# Altium project Tesis.PrjPcb (part 1 of 2)
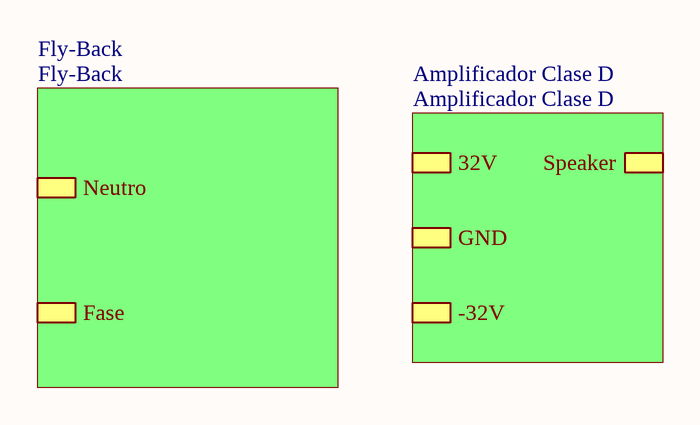
[diagram p0: Diagrama en bloques.SchDoc]
15 sheets, 358 parts. Net scope: hierarchical (ports join the sheet entries above them; power ports are global).
Board files: Filtros.PcbDoc, Flyback.PcbDoc, Amplificador Clase D.PcbDoc, Micro y BT.PcbDoc
Sheets:
  Diagrama en bloques.SchDoc
    Amplificador Clase D = Amplificador Clase D.SchDoc
      Triangular = Triangular.SchDoc
      Generador De Retardo = Generador De Retardo.SchDoc
      Mosfet Driver = Mosfet Driver.SchDoc
      Feedback = Feedback.SchDoc
      U_Filtros = Filtros.SchDoc
        Pasa Bajos = Pasa Bajos.SchDoc
        Pasa Altos = Pasa Altos.SchDoc
        Pasa Banda Inferior = Pasa Banda Inferior.SchDoc
        Pasa Banda Superior = Pasa Banda Superior.SchDoc
      Micro y BT = Micro y BT.SchDoc
    Fly-Back = Fly-Back.SchDoc
      Positive Pwr = Positive Pwr.SchDoc
      Negative Pwr = Negative Pwr.SchDoc

## Sheet Diagrama en bloques.SchDoc
size A4; DocumentNumber: 1; SheetNumber: 1; SheetTotal: 5

### Sub-sheets
Amplificador Clase D = Amplificador Clase D: Speaker, 32V, GND, -32V
Fly-Back = Fly-Back: Fase, Neutro

## Sheet Amplificador Clase D.SchDoc
size A3; DocumentNumber: 5; SheetNumber: 5; SheetTotal: 5
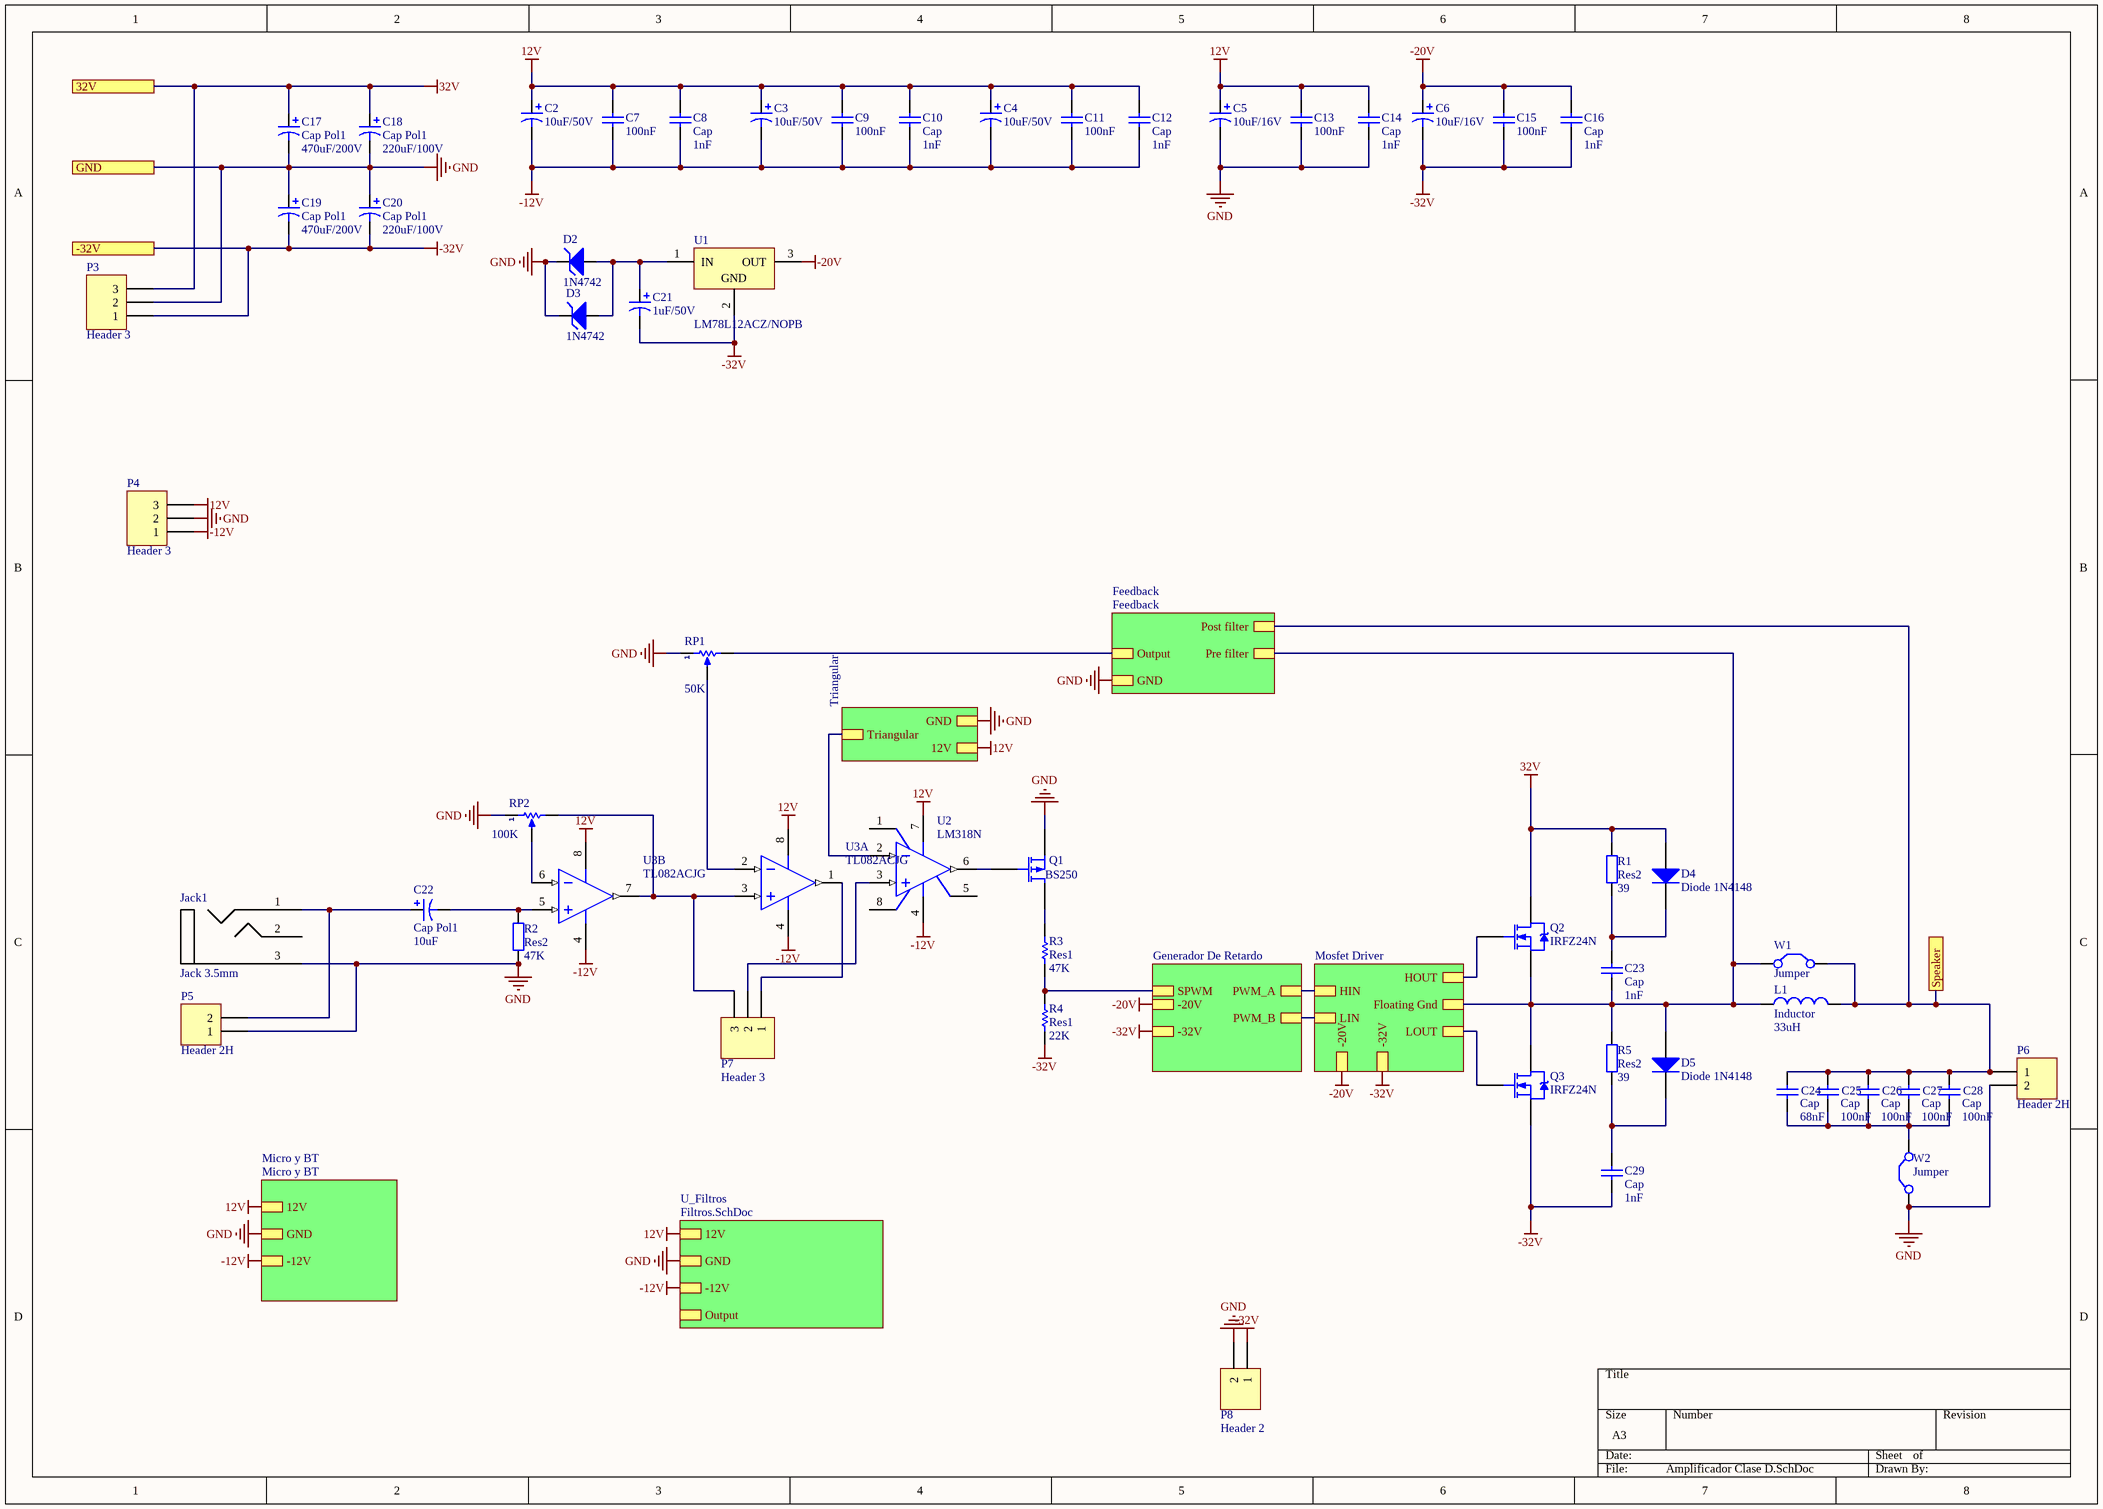
[diagram p1: Amplificador Clase D.SchDoc]

### Parts
C2  VALOR: 10uF/50V  [CAPR D250 H450 R100 mil]  (hidden comment: Cap Electrolitico Radial)
C3  VALOR: 10uF/50V  [CAPR D250 H450 R100 mil]  (hidden comment: Cap Electrolitico Radial)
C4  VALOR: 10uF/50V  [CAPR D250 H450 R100 mil]  (hidden comment: Cap Electrolitico Radial)
C5  VALOR: 10uF/16V  [CAPR D250 H450 R100 mil]  (hidden comment: Cap Electrolitico Radial)
C6  VALOR: 10uF/16V  [CAPR D250 H450 R100 mil]  (hidden comment: Cap Electrolitico Radial)
C7  VALOR: 100nF  [RAD-0.3]  (hidden comment: Cap Ceramico Disco)
C8  Cap  value 1nF  [CAP DISCO 200mil]
C9  VALOR: 100nF  [RAD-0.3]  (hidden comment: Cap Ceramico Disco)
C10  Cap  value 1nF  [CAP DISCO 200mil]
C11  VALOR: 100nF  [RAD-0.3]  (hidden comment: Cap Ceramico Disco)
C12  Cap  value 1nF  [CAP DISCO 200mil]
C13  VALOR: 100nF  [RAD-0.3]  (hidden comment: Cap Ceramico Disco)
C14  Cap  value 1nF  [CAP DISCO 200mil]
C15  VALOR: 100nF  [RAD-0.3]  (hidden comment: Cap Ceramico Disco)
C16  Cap  value 1nF  [CAP DISCO 200mil]
C17  Cap Pol1  value 470uF/200V  [CAPR D700 H1400 R300 mil]
C18  Cap Pol1  value 220uF/100V  [CAPR D500 H1000 R200 mil]
C19  Cap Pol1  value 470uF/200V  [CAPR D700 H1400 R300 mil]
C20  Cap Pol1  value 220uF/100V  [CAPR D500 H1000 R200 mil]
C21  VALOR: 1uF/50V  [CAPR D250 H450 R100 mil]  (hidden comment: Cap Electrolitico Radial)
C22  Cap Pol1  value 10uF  [CAPR D250 H450 R100 mil]
C23  Cap  value 1nF  [CAP DISCO 200mil]
C24  Cap  value 68nF  [RAD-0.4]
C25  Cap  value 100nF  [RAD-0.4]
C26  Cap  value 100nF  [RAD-0.4]
C27  Cap  value 100nF  [RAD-0.4]
C28  Cap  value 100nF  [RAD-0.4]
C29  Cap  value 1nF  [CAP DISCO 200mil]
D2  VALOR: 1N4742  [DO-41]  (hidden comment: Diodo Zener)
D3  VALOR: 1N4742  [DO-41]  (hidden comment: Diodo Zener)
D4  Diode 1N4148  [DO-41]
D5  Diode 1N4148  [DO-41]
Jack1  Jack 3.5mm  [jack 3.5mm]
L1  Inductor  value 33uH  [Bobina 1.5*3]
P3  Header 3  [bornera 3]
P4  Header 3  [bornera 3]
P5  Header 2H  [bornera 2]
P6  Header 2H  [bornera 2]
P7  Header 3  [HDR1X3]
P8  Header 2  [HDR1X2]
Q1  BS250  [TO-92W]
Q2  IRFZ24N  [TO-220AB]
Q3  IRFZ24N  [TO-220AB]
R1  Res2  value 39  [AXIAL-0.4]
R2  Res2  value 47K  [1206 resistor]
R3  Res1  value 47K  [1206 resistor]
R4  Res1  value 22K  [1206 resistor]
R5  Res2  value 39  [AXIAL-0.4]
RP1  VALOR: 50K  [Trimpot Multivuelta Vertical]  (hidden comment: Trimpot)
RP2  VALOR: 100K  [Trimpot Multivuelta Vertical]  (hidden comment: Trimpot)
U1  LM78L12ACZ/NOPB  [to-220]
U2  LM318N  [DIP-8]
U3  TL082ACJG  [693-02]  (parts A,B of 2)
W1  Jumper  [RAD-0.2]
W2  Jumper  [RAD-0.2]

### Sub-sheets
Feedback = Feedback: Output, Pre filter, Post filter, GND
Generador De Retardo = Generador De Retardo: SPWM, PWM_A, PWM_B, -20V, -32V
Micro y BT = Micro y BT: 12V, GND, -12V
Mosfet Driver = Mosfet Driver: HIN, LIN, HOUT, LOUT, Floating Gnd, -20V, -32V
Triangular = Triangular: Triangular, 12V, GND
U_Filtros = Filtros.SchDoc: 12V, Output, GND, -12V

### Ports
32V, -32V, GND, Speaker

### Nets
12V: C2.1 C3.1 C4.1 C5.1 C7.2 C8.2 C9.2 C10.2 C11.2 C12.2 C13.2 C14.2 P4.3 U2.7(V+) U3.8(V+) ; sheet Triangular/12V, sheet U_Filtros/12V, sheet Micro y BT/12V
32V: C17.1 C18.1 D4.1(A) P3.3 Q2.2(D) R1.2 ; port 32V
-12V: C2.2 C3.2 C4.2 C7.1 C8.1 C9.1 C10.1 C11.1 C12.1 P4.1 U2.4(V-) U3.4(V-) ; sheet U_Filtros/-12V, sheet Micro y BT/-12V
-20V: C6.1 C15.2 C16.2 U1.3(OUT) ; sheet Generador De Retardo/-20V, sheet Mosfet Driver/-20V
-32V: C6.2 C15.1 C16.1 C19.2 C20.2 C21.2 C29.1 P3.1 P8.1 Q3.3(S) R4.1 U1.2(GND) ; port -32V, sheet Generador De Retardo/-32V, sheet Mosfet Driver/-32V
GND: C5.2 C13.1 C14.1 C17.2 C18.2 C19.1 C20.1 D2.2(K) D3.2(K) Jack1.3(Gnd) P3.2 P4.2 P5.1 P6.2 P8.2 Q1.3(S) R2.1 RP1.1(TOP) RP2.1(TOP) W2.1(C1) ; port GND, sheet Triangular/GND, sheet Feedback/GND, sheet U_Filtros/GND, sheet Micro y BT/GND
Net1_3: R3.1 R4.2 ; sheet Generador De Retardo/SPWM
Net1_6: sheet Generador De Retardo/PWM_B, sheet Mosfet Driver/LIN
Net1_12: sheet Generador De Retardo/PWM_A, sheet Mosfet Driver/HIN
NetC21_1: C21.1 D2.1(A) D3.1(A) U1.1(IN)
NetC22_1: C22.1 Jack1.1(R) P5.2
NetC22_2: C22.2 R2.2 U3.5(IN+)
NetC23_1: C23.1 D5.1(A) L1.1 Q2.3(S) Q3.2(D) R5.2 W1.1(C1) ; sheet Mosfet Driver/Floating Gnd, sheet Feedback/Pre filter
NetC23_2: C23.2 D4.2(K) R1.1
NetC24_1: C24.1 C25.1 C26.1 C27.1 C28.1 W2.2(C2)
NetC24_2: C24.2 C25.2 C26.2 C27.2 C28.2 L1.2 P6.1 W1.2(C2) ; port Speaker, sheet Feedback/Post filter
NetC29_2: C29.2 D5.2(K) R5.1
NetD8_1: Q2.1(G) ; sheet Mosfet Driver/HOUT
NetD10_1: Q3.1(G) ; sheet Mosfet Driver/LOUT
NetP7_1: P7.1 U3.1(OUT)
NetP7_2: P7.2 U2.3(IN+)
NetP7_3: P7.3 RP2.2(BOT) U3.3(IN+) U3.7(OUT)
NetP14_2: RP1.2(BOT) ; sheet Feedback/Output
NetQ1_1: Q1.1(D) R3.2
NetQ1_2: Q1.2(G) U2.6(OUT)
NetR7_1: U2.2(IN-) ; sheet Triangular/Triangular
NetRP1_3: RP1.3(TAP) U3.2(IN-)
NetRP2_3: RP2.3(TAP) U3.6(IN-)

Not connected (* = marked no-connect by the designer): Jack1 2(L); U2 1(BAL/COMP1) 5(BAL/COMP3) 8(COMP2)

### Library data of the parts
C2-C6 C21 = Cap Electrolitico Radial: Cap Electrolitico de insercion; CODIGO STI: *; PROVEEDOR: *; FABRICANTE: *
C7 C9 C11 C13 C15 = Cap Ceramico Disco: Capacitor Ceramico de Insercion; FABRICANTE: Generico; CODIGO STI: *; PROVEEDOR: *
C8 C10 C12 C14 C16 C23-C29 = Cap: Capacitor; Published: 8-Jun-2000; LatestRevisionDate: 17-Jul-2002; LatestRevisionNote: Re-released for DXP Platform.; PackageReference: RAD-0.3; Publisher: Altium Limited; PackageDescription: Radial Cap, Thru-Hole; 2 Leads; 0.3 in Pin Spacing
C17-C20 C22 = Cap Pol1: Polarized Capacitor (Radial); Published: 8-Jun-2000; LatestRevisionDate: 17-Jul-2002; LatestRevisionNote: Re-released for DXP Platform.; PackageReference: RB7.6-15; Publisher: Altium Limited; PackageDescription: Polarized Capacitor (Radial); 2 Leads
D4 D5 = Diode 1N4148: High Conductance Fast Diode; Published: 8-Jun-2000; LatestRevisionDate: 17-Jul-2002; LatestRevisionNote: Re-released for DXP Platform.; DatasheetVersion: 1997; PackageReference: DO-35; Publisher: Altium Limited; PackageDescription: Diode, Axial; Body 3.8 x 1.9 mm (LxDia. max), Lead Dia. 0.53 mm (max); Code_JEDEC: DO-204-AH; ComponentLink1Description: Manufacturer Link; ComponentLink1URL: http://www.fairchildsemi.com/; ComponentLink2Description: Datasheet; ComponentLink2URL: http://www.fairchildsemi.com/ds/1N%2F1N4148.pdf
L1 = Inductor: Code_IEC: 1005; Published: 8-Jun-2000; LatestRevisionDate: 29-May-2009; LatestRevisionNote: IPC-7351 Footprint Added.; PackageReference: 0402-A; Publisher: Altium Limited; PackageDescription: Chip Inductor; Code_JEITA: 0402
P3 P4 P7 = Header 3: Header, 3-Pin; LatestRevisionDate: 17-Jul-2002; LatestRevisionNote: Re-released for DXP Platform.; Publisher: Altium Limited
P5 P6 = Header 2H: Header, 2-Pin, Right Angle; LatestRevisionDate: 17-Jul-2002; LatestRevisionNote: Re-released for DXP Platform.; Publisher: Altium Limited
P8 = Header 2: Header, 2-Pin; LatestRevisionDate: 17-Jul-2002; LatestRevisionNote: Re-released for DXP Platform.; Publisher: Altium Limited
Q1 = MOSFET-P: P-Channel MOSFET; Published: 8-Jun-2000; LatestRevisionDate: 17-Jul-2002; LatestRevisionNote: Re-released for DXP Platform.; PackageVersion: 1995/1996; PackageReference: E3; Publisher: Altium Limited; PackageDescription: TO, Flat Index; 3 In-Line, Axial Leads; Body Dia. 4.6mm; Lead Dia. 0.5 mm (max)
Q2 Q3 = IRFZ24N: HEXFET Power MOSFET; Note: Pin 2 is electrically connected to pin 4.; Published: 8-Jun-2000; LatestRevisionDate: 17-Jul-2002; LatestRevisionNote: Re-released for DXP Platform.; DatasheetVersion: Sep-1999; PackageVersion: Feb-1997; PackageReference: TO-220AB; Publisher: Altium Limited; PackageDescription: TO, Thru-Hole, Vertical, Heatsink Mounted; 3 In-Line Leads; Pitch 2.54 mm; ComponentLink1Description: Manufacturer Link; ComponentLink1URL: http://www.irf.com/; ComponentLink2Description: Datasheet; ComponentLink2URL: http://www.irf.com/product-info/datasheets/data/irfz24n.pdf
R1 R2 R5 = Res2: Resistor; Published: 8-Jun-2000; LatestRevisionDate: 17-Jul-2002; LatestRevisionNote: Re-released for DXP Platform.; PackageReference: AXIAL-0.4; Publisher: Altium Limited; PackageDescription: Axial Device, Thru-Hole; 2 Leads; 0.4 in Pin Spacing
R3 R4 = Res1: Resistor; Published: 8-Jun-2000; LatestRevisionDate: 17-Jul-2002; LatestRevisionNote: Re-released for DXP Platform.; PackageReference: AXIAL-0.3; Publisher: Altium Limited; PackageDescription: Axial Device, Thru-Hole; 2 Leads; 0.3 in Pin Spacing
RP1 RP2 = Trimpot: Preset; CODIGO STI: *; PROVEEDOR: *; FABRICANTE: *
U1 = LM78L12ACZ/NOPB: 3-Terminal Positive Regulators, 3-pin TO-92, Pb-Free; Manufacturer: National Semiconductor; PackageTopMarking: NSXYTT*LM78L*12ACZ; PowerWise: N; CompType: LDO IC; Published: 1-Mar-2010; DatasheetVersion: Apr-2006; PackageVersion: revG, Sep-2000; PackageReference: Z03A; Publisher: Altium Limited; PackageDescription: TO-92, Molded, 3 Lead; Supplier 1: Digi-Key; Supplier Part Number 1: LM78L12ACZ/NOPB-ND; Supplier 2: Farnell; Supplier Part Number 2: 1469110; PartNumber: LM78L12ACZ/NOPB; RoHS: Y; PinCount: 3; Code_JEDEC: TO-226-AA; ComponentLink1Description: LM78L12 Datasheet; ComponentLink1URL: http://www.national.com/ds/LM/LM78L12.pdf; ComponentLink2Description: LM78L12 Web Page; ComponentLink2URL: http://www.national.com/pf/LM/LM78L12.html; ComponentLink3Description: Z03A Package Page; ComponentLink3URL: http://www.national.com/packaging/folders/z03a.html
U2 = LM318N: Operational Amplifier, 8-pin MDIP; Manufacturer: National Semiconductor; PackageTopMarking: NSUZXYTTE#*LM*318N; PowerWise: N; CompType: Amplifiers; Published: 4-Dec-2008; DatasheetVersion: Aug-2000; PackageVersion: revG, May-2006; PackageReference: N08E; Publisher: Altium Limited; PackageDescription: MDIP, .365 x .250 x .130in, 8 Lead, .100in Pitch; Supplier 1: Farnell; Supplier Part Number 1: 398550; PartNumber: LM318N; RoHS: N; PinCount: 8; Code_JEDEC: MS-001-BA; ComponentLink1Description: LM318 Datasheet; ComponentLink1URL: http://www.national.com/ds/LM/LM318.pdf; ComponentLink2Description: LM318 Web Page; ComponentLink2URL: http://www.national.com/pf/LM/LM318.html; ComponentLink3Description: N08E Package Page; ComponentLink3URL: http://www.national.com/packaging/folders/n08e.html
U3 = TL082ACJG: JFET-Input Operational Amplifier; Published: 17-Jul-2002; LatestRevisionDate: 06-Jun-2005; LatestRevisionNote: Stylized 3D Model Added.; DatasheetVersion: 1988; PackageReference: 693-02; Publisher: Altium Limited; PackageDescription: DIP; 8 Leads; Row Spacing 7.62 mm; Pitch 2.54 mm; Code_JEDEC: MO-001-AN; ComponentLink1Description: Manufacturer Link; ComponentLink1URL: http://www.onsemi.com/site/products/parametrics/0,4446,251,00.html
W1 W2 = Jumper: Jumper Wire; Published: 24-Mar-1999; LatestRevisionDate: 17-Jul-2002; LatestRevisionNote: Re-released for DXP Platform.; PackageReference: RAD-0.2; Publisher: Altium Limited; PackageDescription: Radial Cap, Thru-Hole; 2 Leads; 0.2 in Pin Spacing
D2 D3 = Diodo Zener: CODIGO STI: *; PROVEEDOR: *; FABRICANTE: *

## Sheet Triangular.SchDoc
size A4
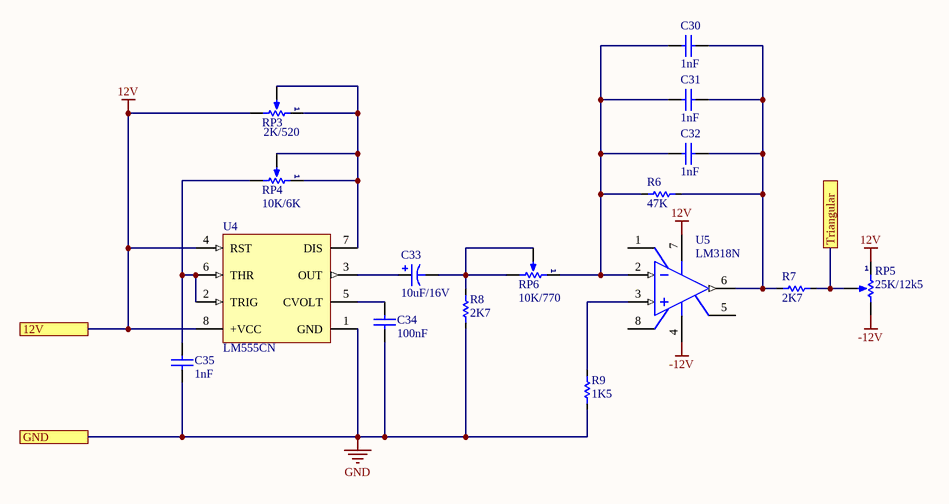
[diagram p2: Triangular.SchDoc]

### Parts
C30  VALOR: 1nF  [CAP DISCO 200mil]  (hidden comment: Cap Ceramico Disco)
C31  VALOR: 1nF  [CAP DISCO 200mil]  (hidden comment: Cap Ceramico Disco)
C32  VALOR: 1nF  [CAP DISCO 200mil]  (hidden comment: Cap Ceramico Disco)
C33  VALOR: 10uF/16V  [CAPR D250 H450 R100 mil]  (hidden comment: Cap Electrolitico Radial)
C34  VALOR: 100nF  [RAD-0.3]  (hidden comment: Cap Ceramico Disco)
C35  VALOR: 1nF  [CAP DISCO 200mil]  (hidden comment: Cap Ceramico Disco)
R6  VALOR: 47K  [1206 resistor]  (hidden comment: Res SMD)
R7  VALOR: 2K7  [1206 resistor]  (hidden comment: Res SMD)
R8  VALOR: 2K7  [1206 resistor]  (hidden comment: Res SMD)
R9  VALOR: 1K5  [1206 resistor]  (hidden comment: Res SMD)
RP3  VALOR: 2K/520  [Trimpot Multivuelta Vertical]  (hidden comment: Trimpot)
RP4  VALOR: 10K/6K  [Trimpot Multivuelta Vertical]  (hidden comment: Trimpot)
RP5  VALOR: 25K/12k5  [Trimpot Multivuelta Vertical]  (hidden comment: Trimpot)
RP6  VALOR: 10K/770  [Trimpot Multivuelta Vertical]  (hidden comment: Trimpot)
U4  LM555CN  [N08E]
U5  LM318N  [DIP-8]

### Ports
12V, GND, Triangular

### Nets
12V: RP3.2(BOT) RP5.1(TOP) U4.4(RST) U4.8(+VCC) U5.7(V+) ; port 12V
-12V: RP5.2(BOT) U5.4(V-)
GND: C34.1 C35.1 R8.1 R9.1 U4.1(GND) ; port GND
NetC30_1: C30.1 C31.1 C32.1 R6.1 R7.2 U5.6(OUT)
NetC30_2: C30.2 C31.2 C32.2 R6.2 RP6.1(TOP) U5.2(IN-)
NetC33_1: C33.1 U4.3(OUT)
NetC33_2: C33.2 R8.2 RP6.2(BOT) RP6.3(TAP)
NetC34_2: C34.2 U4.5(CVOLT)
NetC35_2: C35.2 RP4.2(BOT) U4.2(TRIG) U4.6(THR)
NetR7_1: R7.1 RP5.3(TAP) ; port Triangular
NetR9_2: R9.2 U5.3(IN+)
NetRP3_1: RP3.1(TOP) RP3.3(TAP) RP4.1(TOP) RP4.3(TAP) U4.7(DIS)

Not connected (* = marked no-connect by the designer): U5 1(BAL/COMP1) 5(BAL/COMP3) 8(COMP2)

### Library data of the parts
C30-C32 C34 C35 = Cap Ceramico Disco: as C7 on sheet Amplificador Clase D; CODIGO STI: *; PROVEEDOR: *
C33 = Cap Electrolitico Radial: Cap Electrolitico de insercion; CODIGO STI: *; PROVEEDOR: *; FABRICANTE: *
RP3-RP6 = Trimpot: Preset; CODIGO STI: *; PROVEEDOR: *; FABRICANTE: *
U4 = LM555CN: Timer, 8-pin MDIP; Manufacturer: National Semiconductor; PackageTopMarking: NSUZXYTTE#*LM*555CN; PowerWise: N; CompType: Analog IC; Published: 4-Dec-2008; DatasheetVersion: Jul-2006; PackageVersion: revG, May-2006; PackageReference: N08E; Publisher: Altium Limited; PackageDescription: MDIP, .365 x .250 x .130in, 8 Lead, .100in Pitch; Supplier 1: Farnell; Supplier Part Number 1: 9488235; PartNumber: LM555CN; RoHS: N; PinCount: 8; Code_JEDEC: MS-001-BA; ComponentLink1Description: LM555 Datasheet; ComponentLink1URL: http://www.national.com/ds/LM/LM555.pdf; ComponentLink2Description: LM555 Web Page; ComponentLink2URL: http://www.national.com/pf/LM/LM555.html; ComponentLink3Description: N08E Package Page; ComponentLink3URL: http://www.national.com/packaging/folders/n08e.html
U5 = LM318N: as U2 on sheet Amplificador Clase D; Published: 4-Dec-2008; DatasheetVersion: Aug-2000; PackageVersion: revG, May-2006; PackageReference: N08E; Publisher: Altium Limited; PackageDescription: MDIP, .365 x .250 x .130in, 8 Lead, .100in Pitch; Supplier 1: Farnell; Supplier Part Number 1: 398550; PartNumber: LM318N; RoHS: N; PinCount: 8; Code_JEDEC: MS-001-BA; ComponentLink1Description: LM318 Datasheet; ComponentLink1URL: http://www.national.com/ds/LM/LM318.pdf; ComponentLink2Description: LM318 Web Page; ComponentLink2URL: http://www.national.com/pf/LM/LM318.html; ComponentLink3Description: N08E Package Page; ComponentLink3URL: http://www.national.com/packaging/folders/n08e.html
R6-R9 = Res SMD: CODIGO STI: *; PROVEEDOR: *; FABRICANTE: *

## Sheet Generador De Retardo.SchDoc
size A4
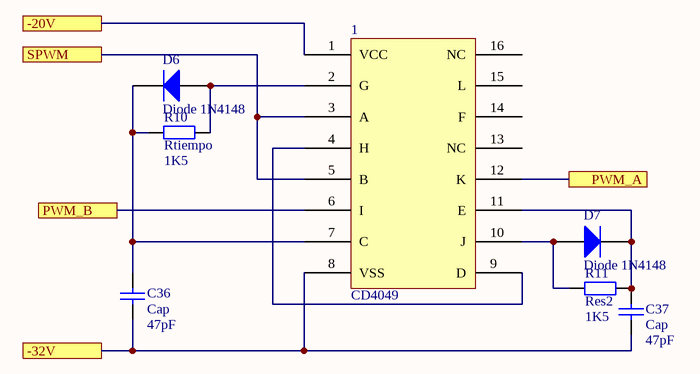
[diagram p3: Generador De Retardo.SchDoc]

### Parts
1  CD4049  [PDIP16]
C36  Cap  value 47pF  [CAP DISCO 200mil]
C37  Cap  value 47pF  [CAP DISCO 200mil]
D6  Diode 1N4148  [SOD323-F]
D7  Diode 1N4148  [SOD323-F]
R10  Rtiempo  value 1K5  [1206 resistor]
R11  Res2  value 1K5  [1206 resistor]

### Ports
-20V, -32V, PWM_A, PWM_B, SPWM

### Nets
-20V: 1.1(VCC) ; port -20V
-32V: 1.8(VSS) C36.1 C37.1 ; port -32V
Net1_2: 1.2(G) D6.1(A) R10.2
Net1_3: 1.3(A) 1.5(B) ; port SPWM
Net1_4: 1.4(H) 1.9(D)
Net1_6: 1.6(I) ; port PWM_B
Net1_7: 1.7(C) C36.2 D6.2(K) R10.1
Net1_10: 1.10(J) D7.1(A) R11.1
Net1_11: 1.11(E) C37.2 D7.2(K) R11.2
Net1_12: 1.12(K) ; port PWM_A

Not connected (* = marked no-connect by the designer): 1 13(NC) 14(F) 15(L) 16(NC)

### Library data of the parts
C36 C37 = Cap: Capacitor; Published: 8-Jun-2000; LatestRevisionDate: 17-Jul-2002; LatestRevisionNote: Re-released for DXP Platform.; PackageReference: RAD-0.3; Publisher: Altium Limited; PackageDescription: Radial Cap, Thru-Hole; 2 Leads; 0.3 in Pin Spacing
D6 D7 = Diode 1N4148: High Conductance Fast Diode; Published: 8-Jun-2000; LatestRevisionDate: 17-Jul-2002; LatestRevisionNote: Re-released for DXP Platform.; DatasheetVersion: 1997; PackageReference: DO-35; Publisher: Altium Limited; PackageDescription: Diode, Axial; Body 3.8 x 1.9 mm (LxDia. max), Lead Dia. 0.53 mm (max); Code_JEDEC: DO-204-AH; ComponentLink1Description: Manufacturer Link; ComponentLink1URL: http://www.fairchildsemi.com/; ComponentLink2Description: Datasheet; ComponentLink2URL: http://www.fairchildsemi.com/ds/1N%2F1N4148.pdf
R10 R11 = Res2: Resistor; Published: 8-Jun-2000; LatestRevisionDate: 17-Jul-2002; LatestRevisionNote: Re-released for DXP Platform.; PackageReference: AXIAL-0.4; Publisher: Altium Limited; PackageDescription: Axial Device, Thru-Hole; 2 Leads; 0.4 in Pin Spacing

## Sheet Mosfet Driver.SchDoc
size A4
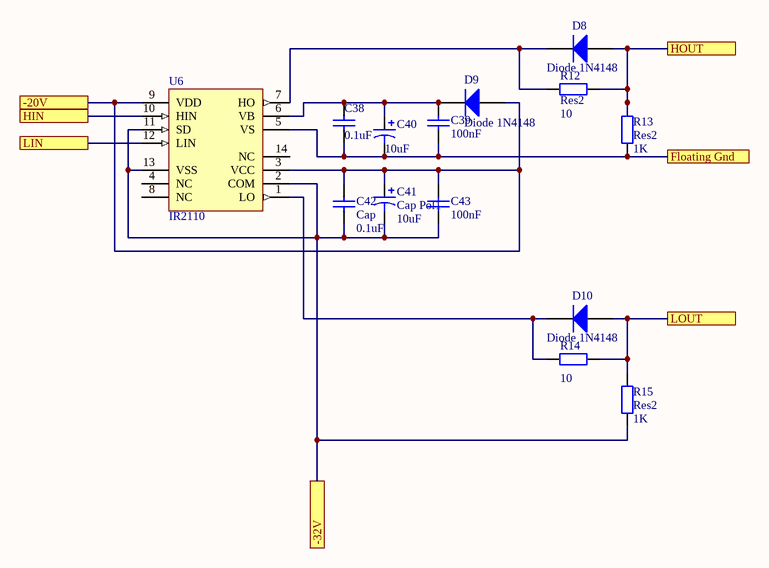
[diagram p4: Mosfet Driver.SchDoc]

### Parts
C38  value 0.1uF  [CAP DISCO 200mil]  (hidden comment: Cap)
C39  VALOR: 100nF  [RAD-0.3]  (hidden comment: Cap Ceramico Disco)
C40  value 10uF  [CAPR D250 H450 R100 mil]  (hidden comment: Cap Pol1)
C41  Cap Pol1  value 10uF  [CAPR D250 H450 R100 mil]
C42  Cap  value 0.1uF  [CAP DISCO 200mil]
C43  VALOR: 100nF  [RAD-0.3]  (hidden comment: Cap Ceramico Disco)
D8  Diode 1N4148  [SOD323-F]
D9  Diode 1N4148  [SOD323-F]
D10  Diode 1N4148  [SOD323-F]
R12  Res2  value 10  [1206 resistor]
R13  Res2  value 1K  [1206 resistor]
R14  value 10  [1206 resistor]  (hidden comment: Res2)
R15  Res2  value 1K  [1206 resistor]
U6  IR2110  [PDIP14]

### Ports
-20V, -32V, Floating Gnd, HIN, HOUT, LIN, LOUT

### Nets
-20V: C41.1 C42.2 C43.2 D9.1(A) U6.3(VCC) U6.9(VDD) ; port -20V
-32V: C41.2 C42.1 C43.1 R15.2 U6.2(COM) U6.11(SD) U6.13(VSS) ; port -32V
Net1_6: U6.12(LIN) ; port LIN
Net1_12: U6.10(HIN) ; port HIN
NetC23_1: C38.1 C39.1 C40.2 R13.1 U6.5(VS) ; port Floating Gnd
NetC38_2: C38.2 C39.2 C40.1 D9.2(K) U6.6(VB)
NetD8_1: D8.1(A) R12.2 R13.2 ; port HOUT
NetD8_2: D8.2(K) R12.1 U6.7(HO)
NetD10_1: D10.1(A) R14.1 R15.1 ; port LOUT
NetD10_2: D10.2(K) R14.2 U6.1(LO)

Not connected (* = marked no-connect by the designer): U6 4(NC) 8(NC) 14(NC)

### Library data of the parts
C38 C42 = Cap: Capacitor; Published: 8-Jun-2000; LatestRevisionDate: 17-Jul-2002; LatestRevisionNote: Re-released for DXP Platform.; PackageReference: RAD-0.3; Publisher: Altium Limited; PackageDescription: Radial Cap, Thru-Hole; 2 Leads; 0.3 in Pin Spacing
C39 C43 = Cap Ceramico Disco: as C7 on sheet Amplificador Clase D; CODIGO STI: *; PROVEEDOR: *
C40 C41 = Cap Pol1: Polarized Capacitor (Radial); Published: 8-Jun-2000; LatestRevisionDate: 17-Jul-2002; LatestRevisionNote: Re-released for DXP Platform.; PackageReference: RB7.6-15; Publisher: Altium Limited; PackageDescription: Polarized Capacitor (Radial); 2 Leads
D8-D10 = Diode 1N4148: High Conductance Fast Diode; Published: 8-Jun-2000; LatestRevisionDate: 17-Jul-2002; LatestRevisionNote: Re-released for DXP Platform.; DatasheetVersion: 1997; PackageReference: DO-35; Publisher: Altium Limited; PackageDescription: Diode, Axial; Body 3.8 x 1.9 mm (LxDia. max), Lead Dia. 0.53 mm (max); Code_JEDEC: DO-204-AH; ComponentLink1Description: Manufacturer Link; ComponentLink1URL: http://www.fairchildsemi.com/; ComponentLink2Description: Datasheet; ComponentLink2URL: http://www.fairchildsemi.com/ds/1N%2F1N4148.pdf
R12-R15 = Res2: Resistor; Published: 8-Jun-2000; LatestRevisionDate: 17-Jul-2002; LatestRevisionNote: Re-released for DXP Platform.; PackageReference: AXIAL-0.4; Publisher: Altium Limited; PackageDescription: Axial Device, Thru-Hole; 2 Leads; 0.4 in Pin Spacing
U6 = IR2110: High and Low Side Driver; Note: Pins 4, 8 and 14 are not connected; Published: 8-Jun-2000; LatestRevisionDate: 04-Mar-2005; LatestRevisionNote: Stylized 3D Model Added.; DatasheetVersion: PD60147J; PackageReference: PDIP14; Publisher: Altium Limited; PackageDescription: DIP; 14 Leads; Row Spacing 7.62 mm; Pitch 2.54 mm; ComponentLink1Description: Manufacturer Link; ComponentLink1URL: http://www.irf.com/; ComponentLink2Description: Datasheet; ComponentLink2URL: http://www.irf.com/product-info/datasheets/data/ir2110.pdf

## Sheet Feedback.SchDoc
size A4
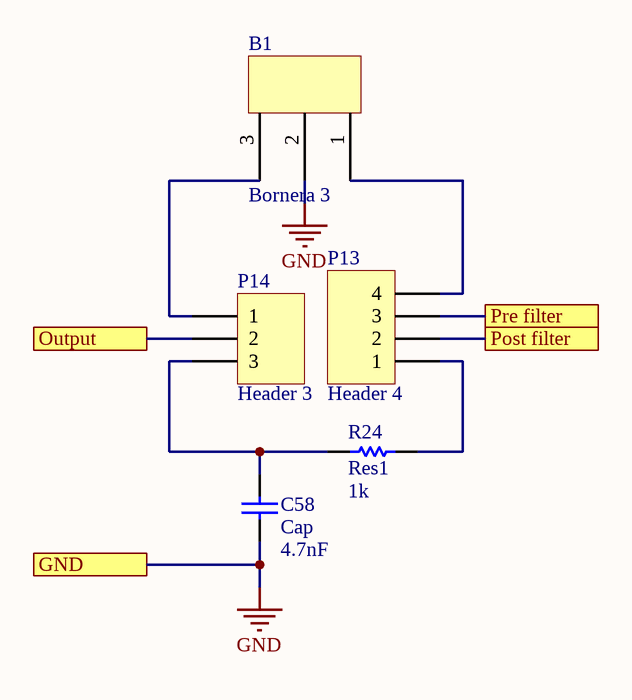
[diagram p5: Feedback.SchDoc]

### Parts
B1  Bornera 3  [bornera 3]
C58  Cap  value 4.7nF  [CAP DISCO 200mil]
P13  Header 4  [HDR1X4]
P14  Header 3  [HDR1X3]
R24  Res1  value 1k  [1206 resistor]

### Ports
GND, Output, Post filter, Pre filter

### Nets
GND: B1.2(L) C58.1 ; port GND
NetB1_1: B1.1(L) P13.4
NetB1_3: B1.3(L) P14.1
NetC23_1: P13.3 ; port Pre filter
NetC24_2: P13.2 ; port Post filter
NetC58_2: C58.2 P14.3 R24.2
NetP13_1: P13.1 R24.1
NetP14_2: P14.2 ; port Output

### Library data of the parts
C58 = Cap: Capacitor; Published: 8-Jun-2000; LatestRevisionDate: 17-Jul-2002; LatestRevisionNote: Re-released for DXP Platform.; PackageReference: RAD-0.3; Publisher: Altium Limited; PackageDescription: Radial Cap, Thru-Hole; 2 Leads; 0.3 in Pin Spacing
P13 = Header 4: Header, 4-Pin; LatestRevisionDate: 17-Jul-2002; LatestRevisionNote: Re-released for DXP Platform.; Publisher: Altium Limited
P14 = Header 3: Header, 3-Pin; LatestRevisionDate: 17-Jul-2002; LatestRevisionNote: Re-released for DXP Platform.; Publisher: Altium Limited
R24 = Res1: Resistor; Published: 8-Jun-2000; LatestRevisionDate: 17-Jul-2002; LatestRevisionNote: Re-released for DXP Platform.; PackageReference: AXIAL-0.3; Publisher: Altium Limited; PackageDescription: Axial Device, Thru-Hole; 2 Leads; 0.3 in Pin Spacing

## Sheet Filtros.SchDoc
size A4; DocumentNumber: 4; SheetNumber: 4; SheetTotal: 5
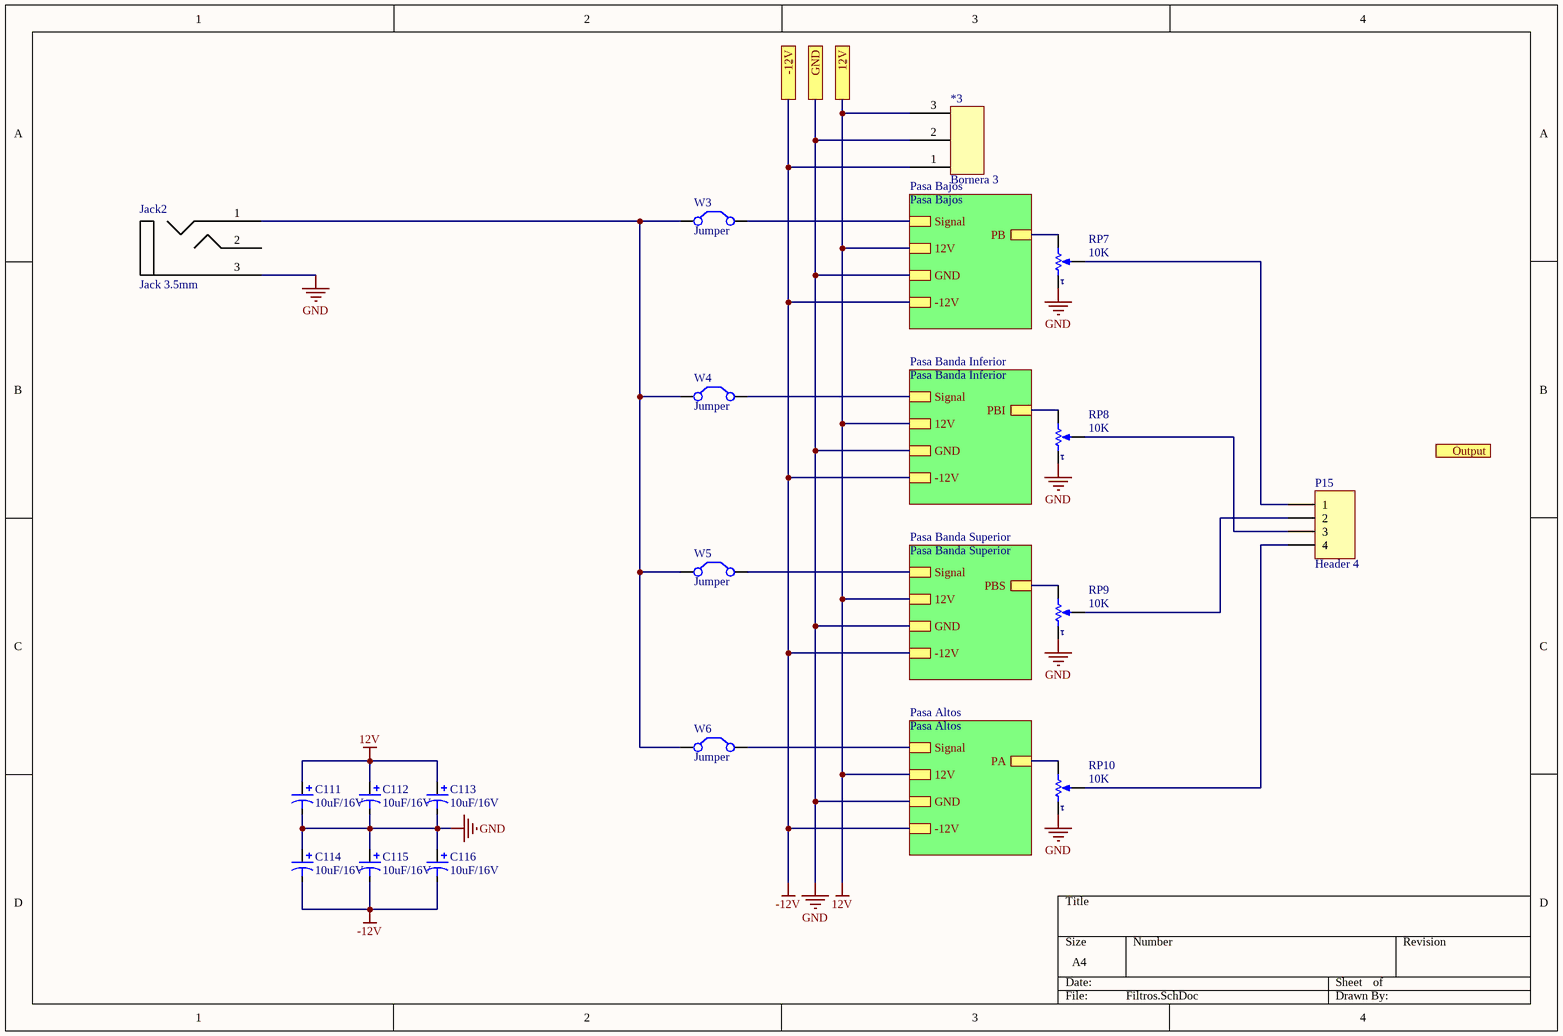
[diagram p6: Filtros.SchDoc]

### Parts
*3  Bornera 3  [bornera 3]
C111  VALOR: 10uF/16V  [CAPR D250 H600 R100 mil]  (hidden comment: Cap Electrolitico Radial)
C112  VALOR: 10uF/16V  [CAPR D250 H600 R100 mil]  (hidden comment: Cap Electrolitico Radial)
C113  VALOR: 10uF/16V  [CAPR D250 H600 R100 mil]  (hidden comment: Cap Electrolitico Radial)
C114  VALOR: 10uF/16V  [CAPR D250 H600 R100 mil]  (hidden comment: Cap Electrolitico Radial)
C115  VALOR: 10uF/16V  [CAPR D250 H600 R100 mil]  (hidden comment: Cap Electrolitico Radial)
C116  VALOR: 10uF/16V  [CAPR D250 H600 R100 mil]  (hidden comment: Cap Electrolitico Radial)
Jack2  Jack 3.5mm  [jack 3.5mm]
P15  Header 4  [Bornera 4]
RP7  VALOR: 10K  [Trimpot Multivuelta Vertical]  (hidden comment: Trimpot)
RP8  VALOR: 10K  [Trimpot Multivuelta Vertical]  (hidden comment: Trimpot)
RP9  VALOR: 10K  [Trimpot Multivuelta Vertical]  (hidden comment: Trimpot)
RP10  VALOR: 10K  [Trimpot Multivuelta Vertical]  (hidden comment: Trimpot)
W3  Jumper  [RAD-0.2]
W4  Jumper  [RAD-0.2]
W5  Jumper  [RAD-0.2]
W6  Jumper  [RAD-0.2]

### Sub-sheets
Pasa Altos = Pasa Altos: Signal, PA, -12V, GND, 12V
Pasa Bajos = Pasa Bajos: Signal, 12V, PB, GND, -12V
Pasa Banda Inferior = Pasa Banda Inferior: Signal, PBI, 12V, GND, -12V
Pasa Banda Superior = Pasa Banda Superior: Signal, PBS, -12V, GND, 12V

### Ports
12V, -12V, GND, Output

### Nets
12V: *3.3(L) C111.1 C112.1 C113.1 ; port 12V, sheet Pasa Bajos/12V, sheet Pasa Altos/12V, sheet Pasa Banda Inferior/12V, sheet Pasa Banda Superior/12V
-12V: *3.1(L) C114.2 C115.2 C116.2 ; port -12V, sheet Pasa Bajos/-12V, sheet Pasa Altos/-12V, sheet Pasa Banda Inferior/-12V, sheet Pasa Banda Superior/-12V
GND: *3.2(L) C111.2 C112.2 C113.2 C114.1 C115.1 C116.1 Jack2.3(Gnd) RP7.1(TOP) RP8.1(TOP) RP9.1(TOP) RP10.1(TOP) ; port GND, sheet Pasa Bajos/GND, sheet Pasa Altos/GND, sheet Pasa Banda Inferior/GND, sheet Pasa Banda Superior/GND
NetC59_2: W6.2(C2) ; sheet Pasa Altos/Signal
NetC68_2: RP7.2(BOT) ; sheet Pasa Bajos/PB
NetJack2_1: Jack2.1(R) W3.1(C1) W4.1(C1) W5.1(C1) W6.1(C1)
NetP15_1: P15.1 RP7.3(TAP)
NetP15_2: P15.2 RP9.3(TAP)
NetP15_3: P15.3 RP8.3(TAP)
NetP15_4: P15.4 RP10.3(TAP)
NetR29_1: RP10.2(BOT) ; sheet Pasa Altos/PA
NetR41_1: W3.2(C2) ; sheet Pasa Bajos/Signal
NetR55_2: RP8.2(BOT) ; sheet Pasa Banda Inferior/PBI
NetR62_1: W4.2(C2) ; sheet Pasa Banda Inferior/Signal
NetR83_2: RP9.2(BOT) ; sheet Pasa Banda Superior/PBS
NetR92_1: W5.2(C2) ; sheet Pasa Banda Superior/Signal

Not connected (* = marked no-connect by the designer): Jack2 2(L)

### Library data of the parts
C111-C116 = Cap Electrolitico Radial: Cap Electrolitico de insercion; CODIGO STI: *; PROVEEDOR: *; FABRICANTE: *; PART NUMBER: *
P15 = Header 4: Header, 4-Pin; LatestRevisionDate: 17-Jul-2002; LatestRevisionNote: Re-released for DXP Platform.; Publisher: Altium Limited
RP7-RP10 = Trimpot: Preset; CODIGO STI: *; PROVEEDOR: *; FABRICANTE: *; PART NUMBER: *
W3-W6 = Jumper: Jumper Wire; Published: 24-Mar-1999; LatestRevisionDate: 17-Jul-2002; LatestRevisionNote: Re-released for DXP Platform.; PackageReference: RAD-0.2; Publisher: Altium Limited; PackageDescription: Radial Cap, Thru-Hole; 2 Leads; 0.2 in Pin Spacing

## Sheet Pasa Bajos.SchDoc
size A4
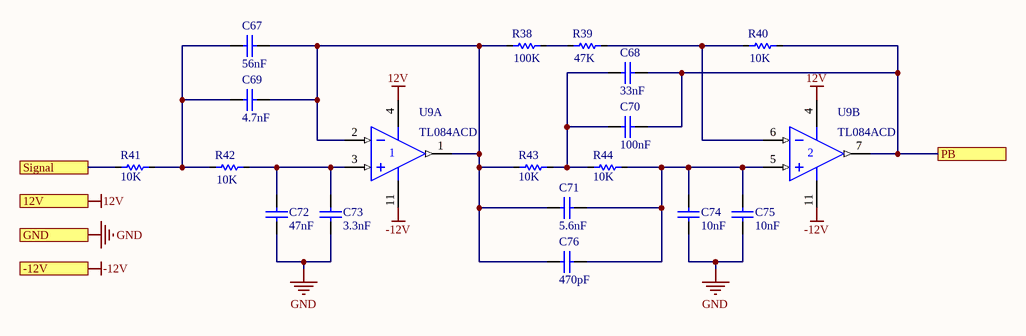
[diagram p7: Pasa Bajos.SchDoc]

### Parts
C67  VALOR: 56nF  [cap 25]  (hidden comment: Cap Ceramico Disco)
C68  VALOR: 33nF  [cap 10]  (hidden comment: Cap Ceramico Disco)
C69  VALOR: 4.7nF  [cap 10]  (hidden comment: Cap Ceramico Disco)
C70  VALOR: 100nF  [CAP DISCO 200mil]  (hidden comment: Cap Ceramico Disco)
C71  VALOR: 5.6nF  [CAP DISCO 200mil]  (hidden comment: Cap Ceramico Disco)
C72  VALOR: 47nF  [cap 10]  (hidden comment: Cap Ceramico Disco)
C73  VALOR: 3.3nF  [CAP DISCO 200mil]  (hidden comment: Cap Ceramico Disco)
C74  VALOR: 10nF  [CAP DISCO 200mil]  (hidden comment: Cap Ceramico Disco)
C75  VALOR: 10nF  [CAP DISCO 200mil]  (hidden comment: Cap Ceramico Disco)
C76  VALOR: 470pF  [CAP DISCO 200mil]  (hidden comment: Cap Ceramico Disco)
R38  VALOR: 100K  [RES AXIAL 400mil]  (hidden comment: Res SMD)
R39  VALOR: 47K  [1206 resistor]  (hidden comment: Res SMD)
R40  VALOR: 10K  [1206 resistor]  (hidden comment: Res SMD)
R41  VALOR: 10K  [1206 resistor]  (hidden comment: Res SMD)
R42  VALOR: 10K  [1206 resistor]  (hidden comment: Res SMD)
R43  VALOR: 10K  [1206 resistor]  (hidden comment: Res SMD)
R44  VALOR: 10K  [1206 resistor]  (hidden comment: Res SMD)
U9  TL084ACD  [751A-02_N]  (parts A,B of 4)

### Ports
12V, -12V, GND, PB, Signal

### Nets
12V: U9.4(V+) ; port 12V
-12V: U9.11(V-) ; port -12V
GND: C72.1 C73.1 C74.2 C75.2 ; port GND
NetC67_1: C67.1 C69.1 C71.2 C76.2 R38.1 R43.1 U9.1(OUT) U9.2(IN-)
NetC67_2: C67.2 C69.2 R41.2 R42.1
NetC68_1: C68.1 C70.1 R43.2 R44.1
NetC68_2: C68.2 C70.2 R40.2 U9.7(OUT) ; port PB
NetC71_1: C71.1 C74.1 C75.1 C76.1 R44.2 U9.5(IN+)
NetC72_2: C72.2 C73.2 R42.2 U9.3(IN+)
NetR38_2: R38.2 R39.1
NetR39_2: R39.2 R40.1 U9.6(IN-)
NetR41_1: R41.1 ; port Signal

### Library data of the parts
C67-C76 = Cap Ceramico Disco: as C7 on sheet Amplificador Clase D; CODIGO STI: *; PROVEEDOR: *
U9 = TL084ACD: JFET-Input Operational Amplifier; Published: 17-Jul-2002; LatestRevisionDate: 13-Apr-2006; LatestRevisionNote: IPC-7351 Footprint Added.; DatasheetVersion: 1988; PackageVersion: 1991; PackageReference: 751A-02; Publisher: Altium Limited; PackageDescription: 14-Pin Small Outline Integrated Circuit 1.27 mm Pitch; Code_IPC: SOIC127P600-14; ComponentLink1Description: Manufacturer Link; ComponentLink1URL: http://www.onsemi.com/site/products/parametrics/0,4446,251,00.html
R38-R44 = Res SMD: CODIGO STI: *; PROVEEDOR: *; FABRICANTE: *; PART NUMBER: *

## Sheet Pasa Altos.SchDoc
size A4
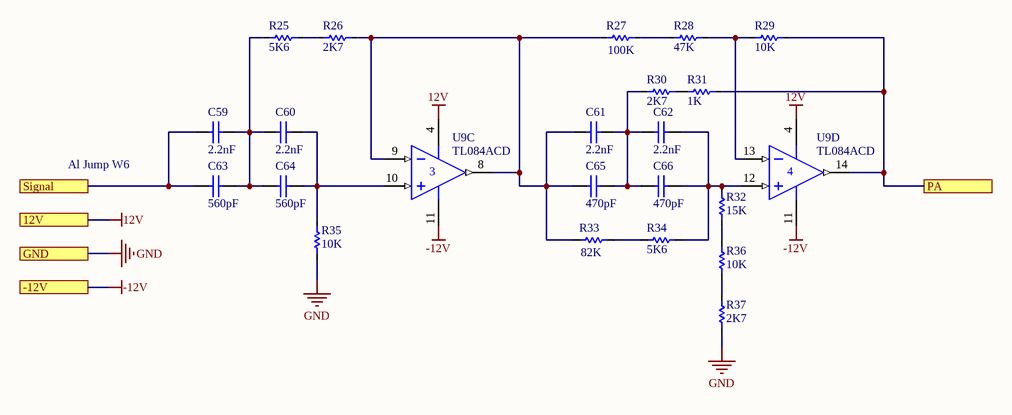
[diagram p8: Pasa Altos.SchDoc]

### Parts
C59  VALOR: 2.2nF  [cap 10]  (hidden comment: Cap Ceramico Disco)
C60  VALOR: 2.2nF  [cap 10]  (hidden comment: Cap Ceramico Disco)
C61  VALOR: 2.2nF  [cap 10]  (hidden comment: Cap Ceramico Disco)
C62  VALOR: 2.2nF  [cap 10]  (hidden comment: Cap Ceramico Disco)
C63  VALOR: 560pF  [CAP DISCO 200mil]  (hidden comment: Cap Ceramico Disco)
C64  VALOR: 560pF  [CAP DISCO 200mil]  (hidden comment: Cap Ceramico Disco)
C65  VALOR: 470pF  [cap 10]  (hidden comment: Cap Ceramico Disco)
C66  VALOR: 470pF  [cap 10]  (hidden comment: Cap Ceramico Disco)
R25  VALOR: 5K6  [1206 resistor]  (hidden comment: Res SMD)
R26  VALOR: 2K7  [1206 resistor]  (hidden comment: Res SMD)
R27  VALOR: 100K  [RES AXIAL 400mil]  (hidden comment: Res SMD)
R28  VALOR: 47K  [1206 resistor]  (hidden comment: Res SMD)
R29  VALOR: 10K  [1206 resistor]  (hidden comment: Res SMD)
R30  VALOR: 2K7  [1206 resistor]  (hidden comment: Res SMD)
R31  VALOR: 1K  [1206 resistor]  (hidden comment: Res SMD)
R32  VALOR: 15K  [1206 resistor]  (hidden comment: Res SMD)
R33  VALOR: 82K  [RES AXIAL 400mil]  (hidden comment: Res SMD)
R34  VALOR: 5K6  [1206 resistor]  (hidden comment: Res SMD)
R35  VALOR: 10K  [1206 resistor]  (hidden comment: Res SMD)
R36  VALOR: 10K  [1206 resistor]  (hidden comment: Res SMD)
R37  VALOR: 2K7  [1206 resistor]  (hidden comment: Res SMD)
U9  TL084ACD  [751A-02_N]  (parts C,D of 4)

### Ports
12V, -12V, GND, PA, Signal

### Nets
12V: U9.4(V+) ; port 12V
-12V: U9.11(V-) ; port -12V
GND: R35.1 R37.2 ; port GND
NetC59_1: C59.1 C60.2 C63.1 C64.2 R25.2
NetC59_2: C59.2 C63.2 ; port Signal
NetC60_1: C60.1 C64.1 R35.2 U9.10(IN+)
NetC61_1: C61.1 C62.2 C65.1 C66.2 R30.2
NetC61_2: C61.2 C65.2 R26.1 R27.1 R33.1 U9.8(OUT) U9.9(IN-)
NetC62_1: C62.1 C66.1 R32.1 R34.1 U9.12(IN+)
NetR25_1: R25.1 R26.2
NetR27_2: R27.2 R28.2
NetR28_1: R28.1 R29.2 U9.13(IN-)
NetR29_1: R29.1 R31.1 U9.14(OUT) ; port PA
NetR30_1: R30.1 R31.2
NetR32_2: R32.2 R36.1
NetR33_2: R33.2 R34.2
NetR36_2: R36.2 R37.1

### Notes on the sheet
- Al Jump W6

### Library data of the parts
C59-C66 = Cap Ceramico Disco: as C7 on sheet Amplificador Clase D; CODIGO STI: *; PROVEEDOR: *
U9 = TL084ACD: JFET-Input Operational Amplifier; Published: 17-Jul-2002; LatestRevisionDate: 13-Apr-2006; LatestRevisionNote: IPC-7351 Footprint Added.; DatasheetVersion: 1988; PackageVersion: 1991; PackageReference: 751A-02; Publisher: Altium Limited; PackageDescription: 14-Pin Small Outline Integrated Circuit 1.27 mm Pitch; Code_IPC: SOIC127P600-14; ComponentLink1Description: Manufacturer Link; ComponentLink1URL: http://www.onsemi.com/site/products/parametrics/0,4446,251,00.html
R25-R37 = Res SMD: CODIGO STI: *; PROVEEDOR: *; FABRICANTE: *; PART NUMBER: *

## Sheet Pasa Banda Inferior.SchDoc
size A3
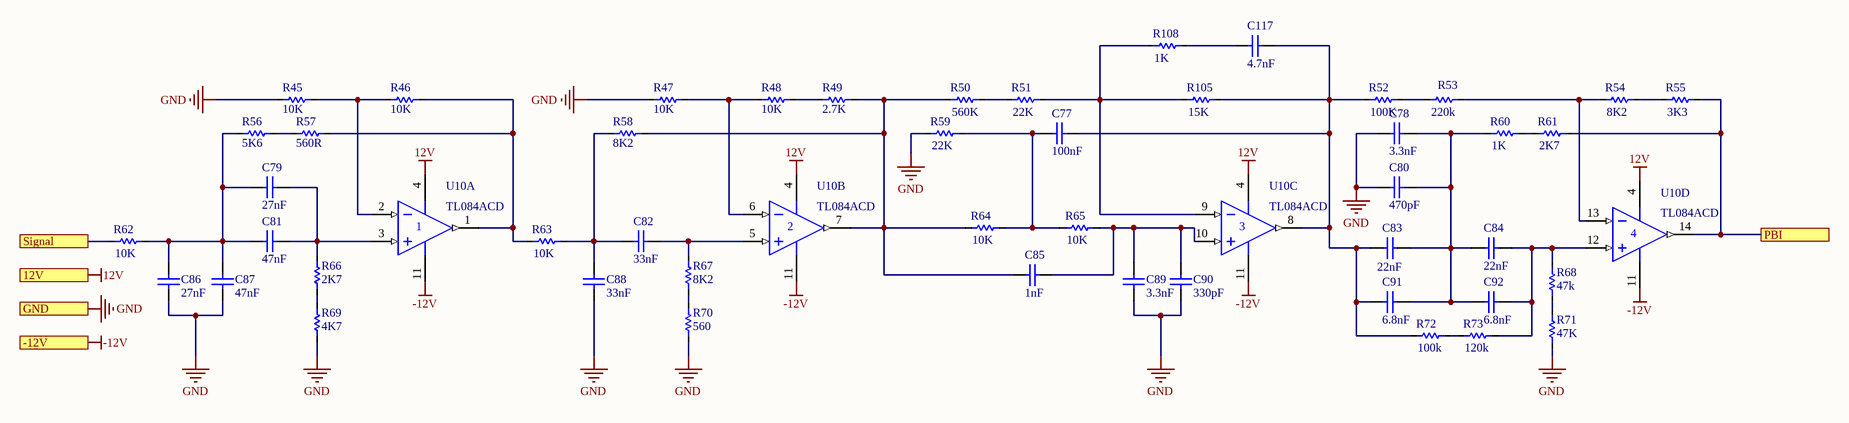
[diagram p9: Pasa Banda Inferior.SchDoc]

### Parts
C77  VALOR: 100nF  [CAP DISCO 200mil]  (hidden comment: Cap Ceramico Disco)
C78  VALOR: 3.3nF  [CAP DISCO 200mil]  (hidden comment: Cap Ceramico Disco)
C79  VALOR: 27nF  [CAP DISCO 200mil]  (hidden comment: Cap Ceramico Disco)
C80  VALOR: 470pF  [cap 10]  (hidden comment: Cap Ceramico Disco)
C81  VALOR: 47nF  [cap 10]  (hidden comment: Cap Ceramico Disco)
C82  VALOR: 33nF  [cap 10]  (hidden comment: Cap Ceramico Disco)
C83  VALOR: 22nF  [cap 10]  (hidden comment: Cap Ceramico Disco)
C84  VALOR: 22nF  [cap 10]  (hidden comment: Cap Ceramico Disco)
C85  VALOR: 1nF  [CAP DISCO 200mil]  (hidden comment: Cap Ceramico Disco)
C86  VALOR: 27nF  [CAP DISCO 200mil]  (hidden comment: Cap Ceramico Disco)
C87  VALOR: 47nF  [cap 10]  (hidden comment: Cap Ceramico Disco)
C88  VALOR: 33nF  [cap 10]  (hidden comment: Cap Ceramico Disco)
C89  VALOR: 3.3nF  [CAP DISCO 200mil]  (hidden comment: Cap Ceramico Disco)
C90  VALOR: 330pF  [CAP DISCO 150mil]  (hidden comment: Cap Ceramico Disco)
C91  VALOR: 6.8nF  [CAP DISCO 200mil]  (hidden comment: Cap Ceramico Disco)
C92  VALOR: 6.8nF  [CAP DISCO 200mil]  (hidden comment: Cap Ceramico Disco)
C117  VALOR: 4.7nF  [CAP DISCO 200mil]  (hidden comment: Cap Ceramico Disco)
R45  VALOR: 10K  [1206 resistor]  (hidden comment: Res SMD)
R46  VALOR: 10K  [1206 resistor]  (hidden comment: Res SMD)
R47  VALOR: 10K  [1206 resistor]  (hidden comment: Res SMD)
R48  VALOR: 10K  [1206 resistor]  (hidden comment: Res SMD)
R49  VALOR: 2.7K  [1206 resistor]  (hidden comment: Res SMD)
R50  VALOR: 560K  [RES AXIAL 400mil]  (hidden comment: Res SMD)
R51  VALOR: 22K  [1206 resistor]  (hidden comment: Res SMD)
R52  VALOR: 100K  [RES AXIAL 400mil]  (hidden comment: Res SMD)
R53  VALOR: 220k  [RES AXIAL 400mil]  (hidden comment: Res SMD)
R54  VALOR: 8K2  [1206 resistor]  (hidden comment: Res SMD)
R55  VALOR: 3K3  [1206 resistor]  (hidden comment: Res SMD)
R56  VALOR: 5K6  [1206 resistor]  (hidden comment: Res SMD)
R57  VALOR: 560R  [1206 resistor]  (hidden comment: Res SMD)
R58  VALOR: 8K2  [1206 resistor]  (hidden comment: Res SMD)
R59  VALOR: 22K  [1206 resistor]  (hidden comment: Res SMD)
R60  VALOR: 1K  [1206 resistor]  (hidden comment: Res SMD)
R61  VALOR: 2K7  [1206 resistor]  (hidden comment: Res SMD)
R62  VALOR: 10K  [1206 resistor]  (hidden comment: Res SMD)
R63  VALOR: 10K  [1206 resistor]  (hidden comment: Res SMD)
R64  VALOR: 10K  [1206 resistor]  (hidden comment: Res SMD)
R65  VALOR: 10K  [1206 resistor]  (hidden comment: Res SMD)
R66  VALOR: 2K7  [1206 resistor]  (hidden comment: Res SMD)
R67  VALOR: 8K2  [1206 resistor]  (hidden comment: Res SMD)
R68  VALOR: 47k  [RES AXIAL 400mil]  (hidden comment: Res SMD)
R69  VALOR: 4K7  [1206 resistor]  (hidden comment: Res SMD)
R70  VALOR: 560  [1206 resistor]  (hidden comment: Res SMD)
R71  VALOR: 47K  [RES AXIAL 400mil]  (hidden comment: Res SMD)
R72  VALOR: 100k  [RES AXIAL 400mil]  (hidden comment: Res SMD)
R73  VALOR: 120k  [RES AXIAL 400mil]  (hidden comment: Res SMD)
R105  VALOR: 15K  [1206 resistor]  (hidden comment: Res SMD)
R108  VALOR: 1K  [1206 resistor]  (hidden comment: Res SMD)
U10  TL084ACD  [751A-02_N]  (parts A,B,C,D of 4)

### Ports
12V, -12V, GND, PBI, Signal

### Nets
12V: U10.4(V+) ; port 12V
-12V: U10.11(V-) ; port -12V
GND: C78.2 C80.2 C86.1 C87.1 C88.1 C89.2 C90.2 R45.2 R47.2 R59.1 R69.1 R70.1 R71.1 ; port GND
NetC77_1: C77.1 C83.2 C91.2 C117.1 R52.1 R72.1 R105.2 U10.8(OUT)
NetC77_2: C77.2 R59.2 R64.2 R65.1
NetC78_1: C78.1 C80.1 C83.1 C84.2 C91.1 C92.2 R60.1
NetC79_1: C79.1 C81.1 R66.2 U10.3(IN+)
NetC79_2: C79.2 C81.2 C86.2 C87.2 R56.2 R62.2
NetC82_1: C82.1 R67.2 U10.5(IN+)
NetC82_2: C82.2 C88.2 R58.2 R63.2
NetC84_1: C84.1 C92.1 R68.2 R73.2 U10.12(IN+)
NetC85_1: C85.1 C89.1 C90.1 R65.2 U10.10(IN+)
NetC85_2: C85.2 R49.1 R50.1 R58.1 R64.1 U10.7(OUT)
NetC117_2: C117.2 R108.2
NetR45_1: R45.1 R46.2 U10.2(IN-)
NetR46_1: R46.1 R57.1 R63.1 U10.1(OUT)
NetR47_1: R47.1 R48.2 U10.6(IN-)
NetR48_1: R48.1 R49.2
NetR50_2: R50.2 R51.1
NetR51_2: R51.2 R105.1 R108.1 U10.9(IN-)
NetR52_2: R52.2 R53.1
NetR53_2: R53.2 R54.1 U10.13(IN-)
NetR54_2: R54.2 R55.1
NetR55_2: R55.2 R61.2 U10.14(OUT) ; port PBI
NetR56_1: R56.1 R57.2
NetR60_2: R60.2 R61.1
NetR62_1: R62.1 ; port Signal
NetR66_1: R66.1 R69.2
NetR67_1: R67.1 R70.2
NetR68_1: R68.1 R71.2
NetR72_2: R72.2 R73.1

### Library data of the parts
C77-C92 C117 = Cap Ceramico Disco: as C7 on sheet Amplificador Clase D; CODIGO STI: *; PROVEEDOR: *
U10 = TL084ACD: JFET-Input Operational Amplifier; Published: 17-Jul-2002; LatestRevisionDate: 13-Apr-2006; LatestRevisionNote: IPC-7351 Footprint Added.; DatasheetVersion: 1988; PackageVersion: 1991; PackageReference: 751A-02; Publisher: Altium Limited; PackageDescription: 14-Pin Small Outline Integrated Circuit 1.27 mm Pitch; Code_IPC: SOIC127P600-14; ComponentLink1Description: Manufacturer Link; ComponentLink1URL: http://www.onsemi.com/site/products/parametrics/0,4446,251,00.html
R45-R73 R105 R108 = Res SMD: CODIGO STI: *; PROVEEDOR: *; FABRICANTE: *; PART NUMBER: *

## Sheet Pasa Banda Superior.SchDoc
size A3
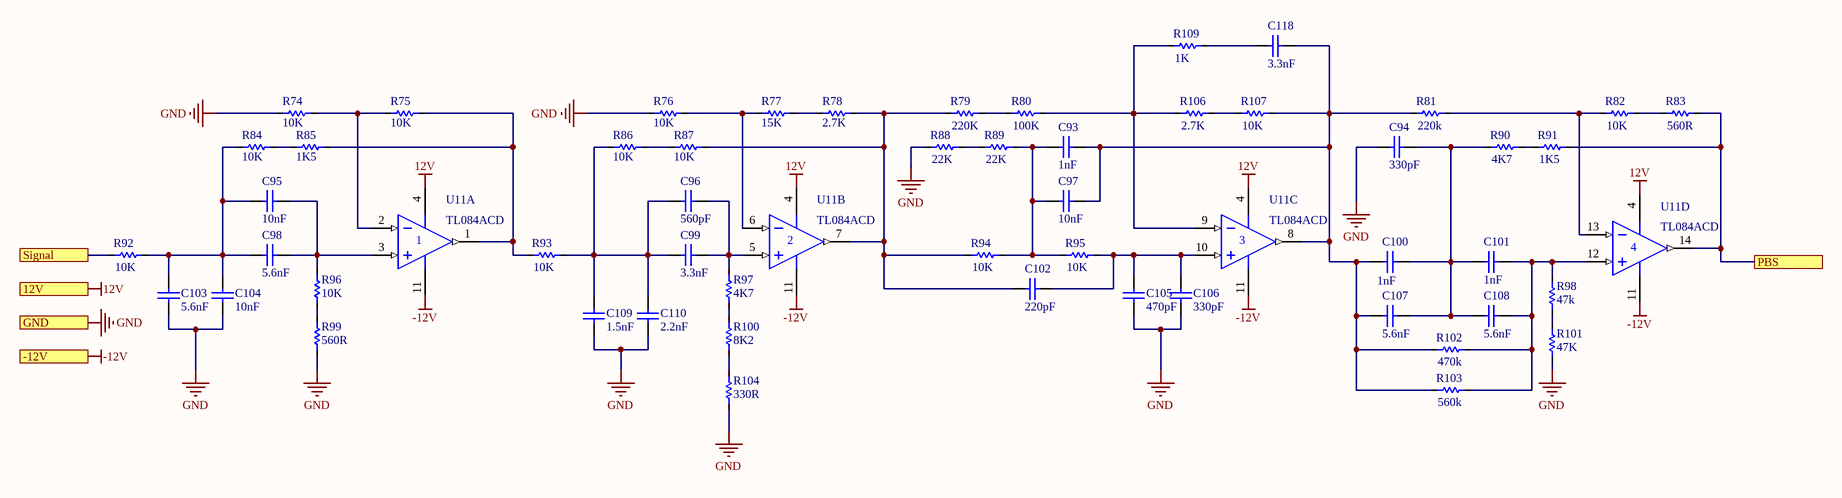
[diagram p10: Pasa Banda Superior.SchDoc]

### Parts
C93  VALOR: 1nF  [CAP DISCO 200mil]  (hidden comment: Cap Ceramico Disco)
C94  VALOR: 330pF  [cap 10]  (hidden comment: Cap Ceramico Disco)
C95  VALOR: 10nF  [cap 10]  (hidden comment: Cap Ceramico Disco)
C96  VALOR: 560pF  [CAP DISCO 200mil]  (hidden comment: Cap Ceramico Disco)
C97  VALOR: 10nF  [CAP DISCO 200mil]  (hidden comment: Cap Ceramico Disco)
C98  VALOR: 5.6nF  [CAP DISCO 200mil]  (hidden comment: Cap Ceramico Disco)
C99  VALOR: 3.3nF  [CAP DISCO 200mil]  (hidden comment: Cap Ceramico Disco)
C100  VALOR: 1nF  [CAP DISCO 200mil]  (hidden comment: Cap Ceramico Disco)
C101  VALOR: 1nF  [CAP DISCO 200mil]  (hidden comment: Cap Ceramico Disco)
C102  VALOR: 220pF  [CAP DISCO 200mil]  (hidden comment: Cap Ceramico Disco)
C103  VALOR: 5.6nF  [CAP DISCO 200mil]  (hidden comment: Cap Ceramico Disco)
C104  VALOR: 10nF  [cap 10]  (hidden comment: Cap Ceramico Disco)
C105  VALOR: 470pF  [cap 10]  (hidden comment: Cap Ceramico Disco)
C106  VALOR: 330pF  [CAP DISCO 150mil]  (hidden comment: Cap Ceramico Disco)
C107  VALOR: 5.6nF  [CAP DISCO 200mil]  (hidden comment: Cap Ceramico Disco)
C108  VALOR: 5.6nF  [CAP DISCO 200mil]  (hidden comment: Cap Ceramico Disco)
C109  VALOR: 1.5nF  [cap 10]  (hidden comment: Cap Ceramico Disco)
C110  VALOR: 2.2nF  [cap 10]  (hidden comment: Cap Ceramico Disco)
C118  VALOR: 3.3nF  [CAP DISCO 200mil]  (hidden comment: Cap Ceramico Disco)
R74  VALOR: 10K  [1206 resistor]  (hidden comment: Res SMD)
R75  VALOR: 10K  [1206 resistor]  (hidden comment: Res SMD)
R76  VALOR: 10K  [1206 resistor]  (hidden comment: Res SMD)
R77  VALOR: 15K  [1206 resistor]  (hidden comment: Res SMD)
R78  VALOR: 2.7K  [1206 resistor]  (hidden comment: Res SMD)
R79  VALOR: 220K  [RES AXIAL 400mil]  (hidden comment: Res SMD)
R80  VALOR: 100K  [RES AXIAL 400mil]  (hidden comment: Res SMD)
R81  VALOR: 220k  [RES AXIAL 400mil]  (hidden comment: Res SMD)
R82  VALOR: 10K  [1206 resistor]  (hidden comment: Res SMD)
R83  VALOR: 560R  [1206 resistor]  (hidden comment: Res SMD)
R84  VALOR: 10K  [1206 resistor]  (hidden comment: Res SMD)
R85  VALOR: 1K5  [1206 resistor]  (hidden comment: Res SMD)
R86  VALOR: 10K  [1206 resistor]  (hidden comment: Res SMD)
R87  VALOR: 10K  [1206 resistor]  (hidden comment: Res SMD)
R88  VALOR: 22K  [1206 resistor]  (hidden comment: Res SMD)
R89  VALOR: 22K  [1206 resistor]  (hidden comment: Res SMD)
R90  VALOR: 4K7  [1206 resistor]  (hidden comment: Res SMD)
R91  VALOR: 1K5  [1206 resistor]  (hidden comment: Res SMD)
R92  VALOR: 10K  [1206 resistor]  (hidden comment: Res SMD)
R93  VALOR: 10K  [1206 resistor]  (hidden comment: Res SMD)
R94  VALOR: 10K  [1206 resistor]  (hidden comment: Res SMD)
R95  VALOR: 10K  [1206 resistor]  (hidden comment: Res SMD)
R96  VALOR: 10K  [1206 resistor]  (hidden comment: Res SMD)
R97  VALOR: 4K7  [1206 resistor]  (hidden comment: Res SMD)
R98  VALOR: 47k  [RES AXIAL 400mil]  (hidden comment: Res SMD)
R99  VALOR: 560R  [1206 resistor]  (hidden comment: Res SMD)
R100  VALOR: 8K2  [1206 resistor]  (hidden comment: Res SMD)
R101  VALOR: 47K  [RES AXIAL 400mil]  (hidden comment: Res SMD)
R102  VALOR: 470k  [RES AXIAL 400mil]  (hidden comment: Res SMD)
R103  VALOR: 560k  [RES AXIAL 400mil]  (hidden comment: Res SMD)
R104  VALOR: 330R  [1206 resistor]  (hidden comment: Res SMD)
R106  VALOR: 2.7K  [1206 resistor]  (hidden comment: Res SMD)
R107  VALOR: 10K  [1206 resistor]  (hidden comment: Res SMD)
R109  VALOR: 1K  [1206 resistor]  (hidden comment: Res SMD)
U11  TL084ACD  [751A-02_N]  (parts A,B,C,D of 4)

### Ports
12V, -12V, GND, PBS, Signal

### Nets
12V: U11.4(V+) ; port 12V
-12V: U11.11(V-) ; port -12V
GND: C94.2 C103.1 C104.1 C105.2 C106.2 C109.1 C110.1 R74.2 R76.2 R88.1 R99.1 R101.1 R104.1 ; port GND
NetC93_1: C93.1 C97.1 C100.2 C107.2 C118.1 R81.1 R102.1 R103.1 R107.1 U11.8(OUT)
NetC93_2: C93.2 C97.2 R89.2 R94.2 R95.1
NetC94_1: C94.1 C100.1 C101.2 C107.1 C108.2 R90.1
NetC95_1: C95.1 C98.1 R96.2 U11.3(IN+)
NetC95_2: C95.2 C98.2 C103.2 C104.2 R84.2 R92.2
NetC96_1: C96.1 C99.1 R97.2 U11.5(IN+)
NetC96_2: C96.2 C99.2 C109.2 C110.2 R86.2 R93.2
NetC101_1: C101.1 C108.1 R98.2 R102.2 R103.2 U11.12(IN+)
NetC102_1: C102.1 C105.1 C106.1 R95.2 U11.10(IN+)
NetC102_2: C102.2 R78.1 R79.1 R87.1 R94.1 U11.7(OUT)
NetC118_2: C118.2 R109.2
NetR74_1: R74.1 R75.2 U11.2(IN-)
NetR75_1: R75.1 R85.1 R93.1 U11.1(OUT)
NetR76_1: R76.1 R77.2 U11.6(IN-)
NetR77_1: R77.1 R78.2
NetR79_2: R79.2 R80.1
NetR80_2: R80.2 R106.2 R109.1 U11.9(IN-)
NetR81_2: R81.2 R82.1 U11.13(IN-)
NetR82_2: R82.2 R83.1
NetR83_2: R83.2 R91.2 U11.14(OUT) ; port PBS
NetR84_1: R84.1 R85.2
NetR86_1: R86.1 R87.2
NetR88_2: R88.2 R89.1
NetR90_2: R90.2 R91.1
NetR92_1: R92.1 ; port Signal
NetR96_1: R96.1 R99.2
NetR97_1: R97.1 R100.2
NetR98_1: R98.1 R101.2
NetR100_1: R100.1 R104.2
NetR106_1: R106.1 R107.2

### Library data of the parts
C93-C110 C118 = Cap Ceramico Disco: as C7 on sheet Amplificador Clase D; CODIGO STI: *; PROVEEDOR: *
U11 = TL084ACD: JFET-Input Operational Amplifier; Published: 17-Jul-2002; LatestRevisionDate: 13-Apr-2006; LatestRevisionNote: IPC-7351 Footprint Added.; DatasheetVersion: 1988; PackageVersion: 1991; PackageReference: 751A-02; Publisher: Altium Limited; PackageDescription: 14-Pin Small Outline Integrated Circuit 1.27 mm Pitch; Code_IPC: SOIC127P600-14; ComponentLink1Description: Manufacturer Link; ComponentLink1URL: http://www.onsemi.com/site/products/parametrics/0,4446,251,00.html
R74-R104 R106 R107 R109 = Res SMD: CODIGO STI: *; PROVEEDOR: *; FABRICANTE: *; PART NUMBER: *

## Sheet Micro y BT.SchDoc
size A2
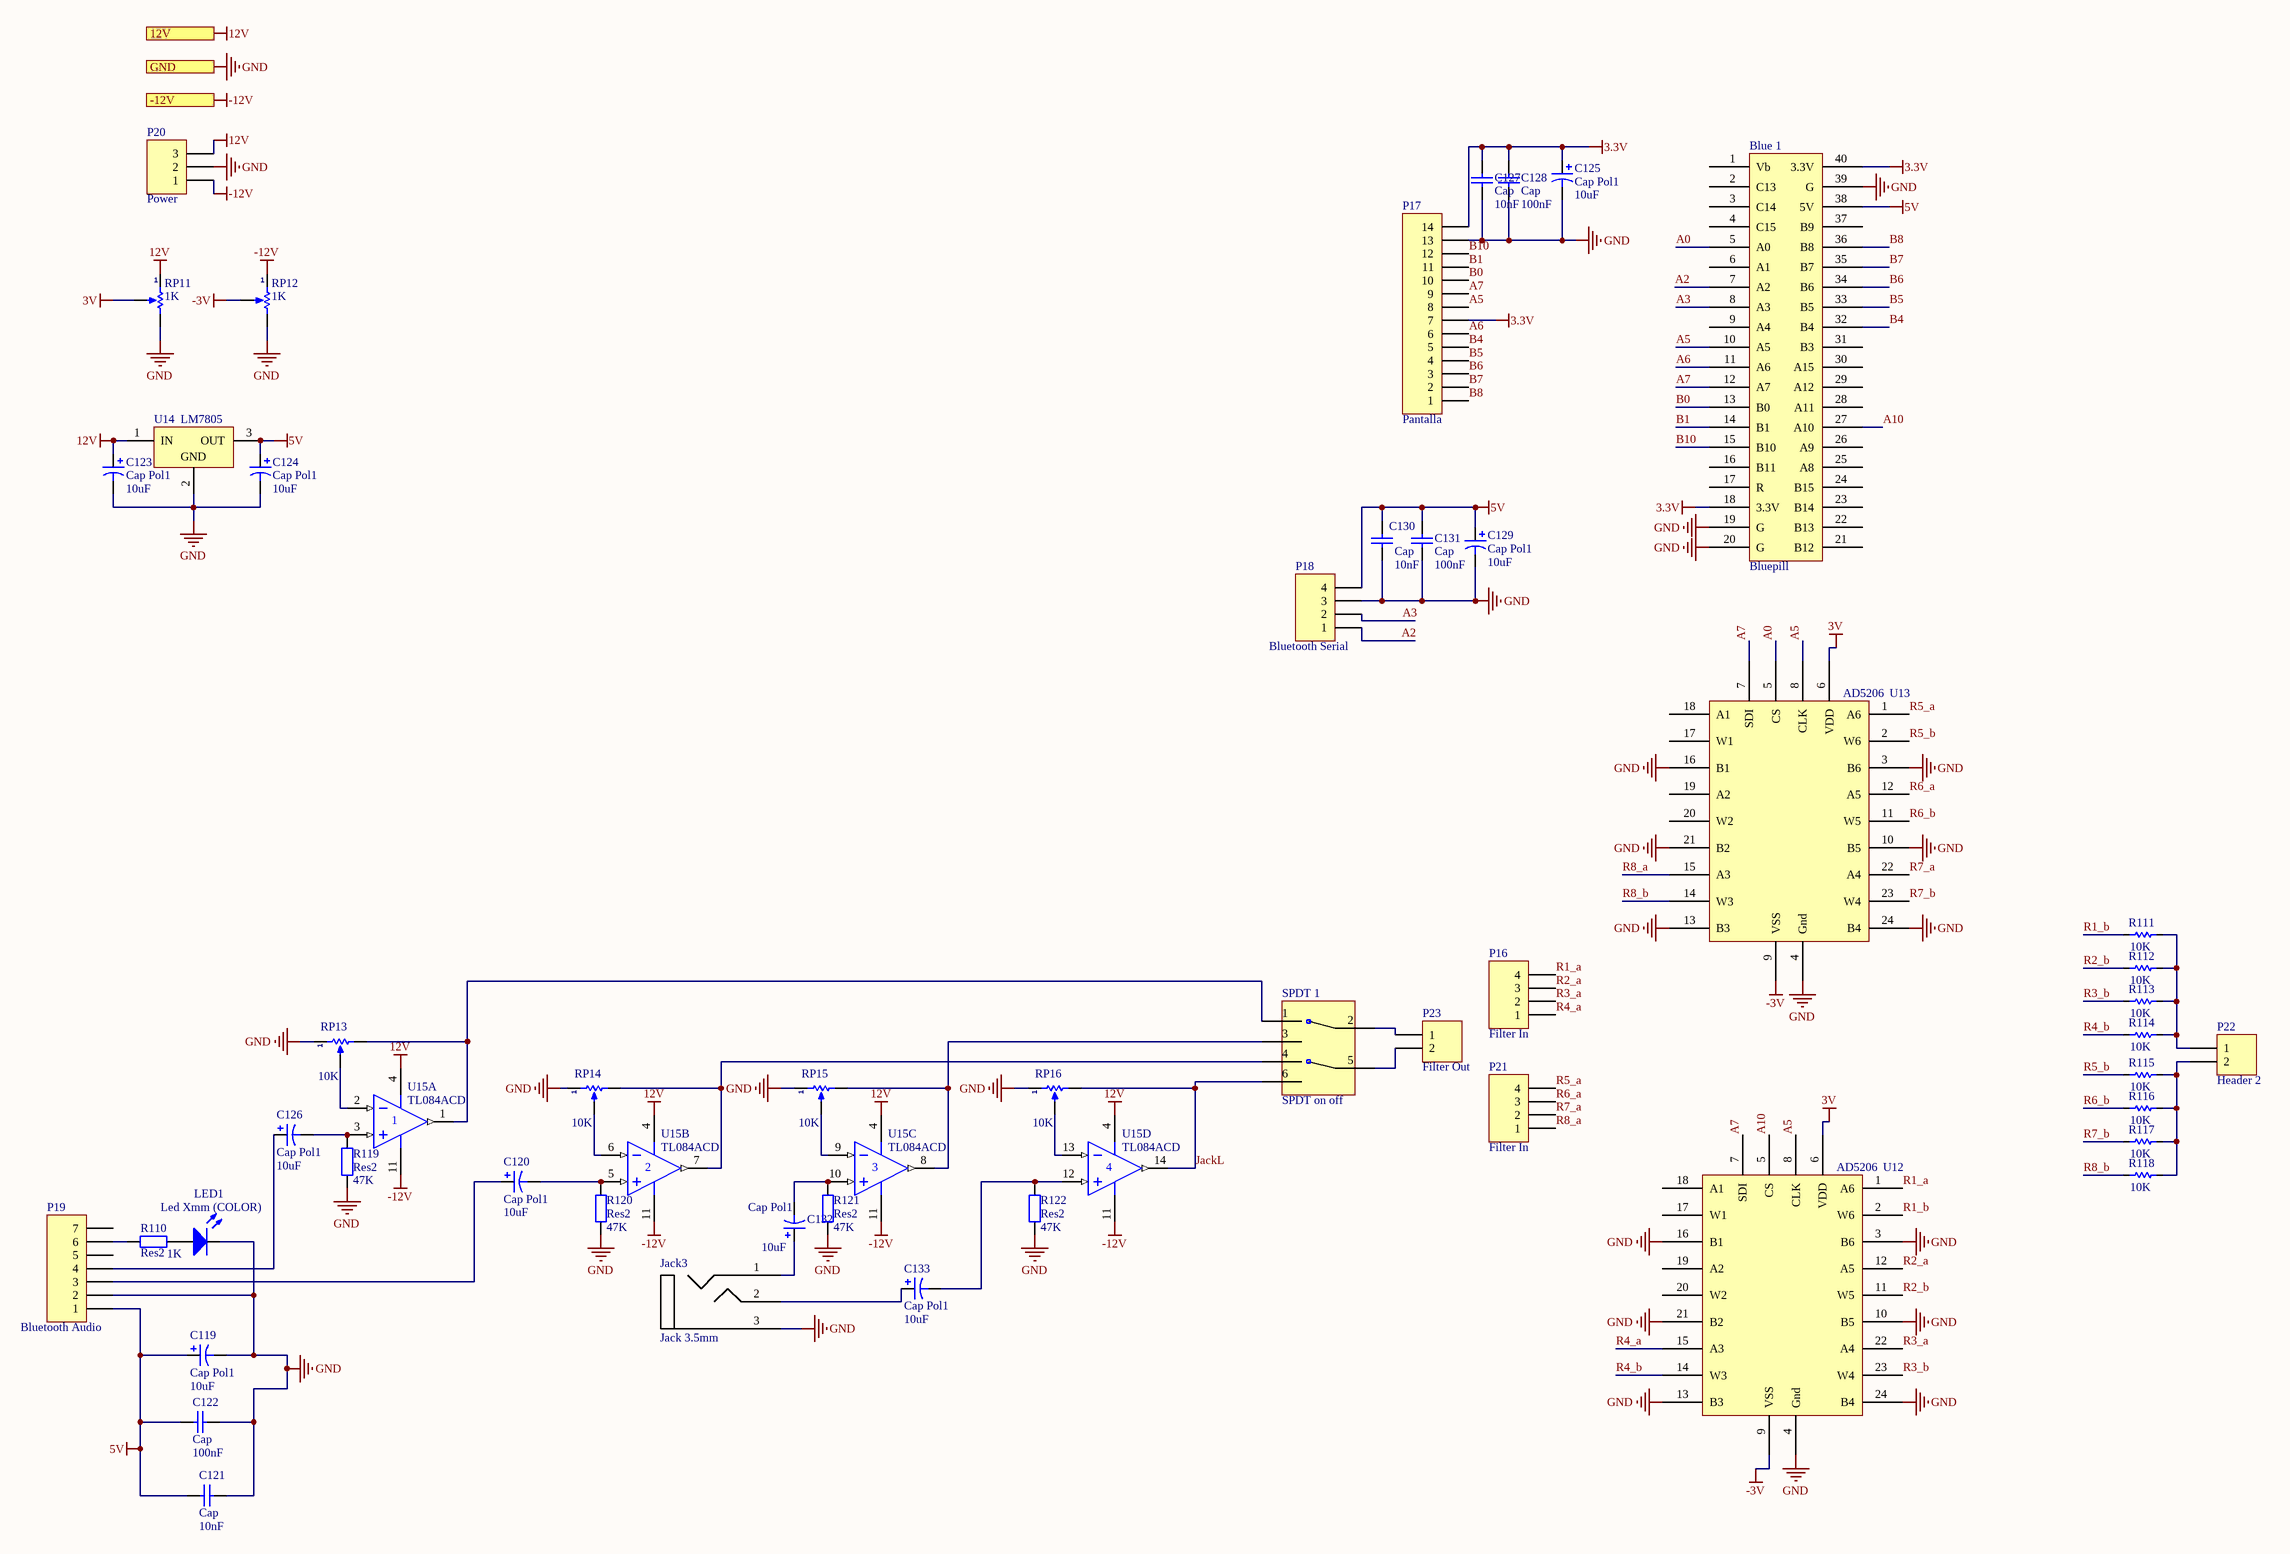
[diagram p11: Micro y BT.SchDoc]

### Parts
Blue_1  Bluepill  [Bluepill]
C119  Cap Pol1  value 10uF  [CAPR D250 H450 R100 mil]
C120  Cap Pol1  value 10uF  [CAPR D250 H450 R100 mil]
C121  Cap  value 10nF  [cap 3]
C122  Cap  value 100nF  [CAP DISCO 200mil]
C123  Cap Pol1  value 10uF  [CAPR D250 H450 R100 mil]
C124  Cap Pol1  value 10uF  [CAPR D250 H450 R100 mil]
C125  Cap Pol1  value 10uF  [CAPR D250 H450 R100 mil]
C126  Cap Pol1  value 10uF  [CAPR D250 H450 R100 mil]
C127  Cap  value 10nF  [RAD-0.3]
C128  Cap  value 100nF  [CAP DISCO 200mil]
C129  Cap Pol1  value 10uF  [CAPR D250 H450 R100 mil]
C130  Cap  value 10nF  [cap 3]
C131  Cap  value 100nF  [CAP DISCO 200mil]
C132  Cap Pol1  value 10uF  [CAPR D250 H450 R100 mil]
C133  Cap Pol1  value 10uF  [CAPR D250 H450 R100 mil]
Jack3  Jack 3.5mm  [jack 3.5mm]
LED1  VALOR: Led Xmm (COLOR)  [Led 3mm AMARILLO]  (hidden comment: Diodo Led)
P16  Filter In  [Bornera 4]
P17  Pantalla  [HDR1X14]
P18  Bluetooth Serial  [HDR1X4]
P19  Bluetooth Audio  [HDR1X7]
P20  Power  [HDR1X3]
P21  Filter In  [Bornera 4]
P22  Header 2  [HDR1X2]
P23  Filter Out  [HDR1X2]
R110  Res2  value 1K  [1206 resistor]
R111  VALOR: 10K  [1206 resistor]  (hidden comment: Res SMD)
R112  VALOR: 10K  [1206 resistor]  (hidden comment: Res SMD)
R113  VALOR: 10K  [1206 resistor]  (hidden comment: Res SMD)
R114  VALOR: 10K  [1206 resistor]  (hidden comment: Res SMD)
R115  VALOR: 10K  [1206 resistor]  (hidden comment: Res SMD)
R116  VALOR: 10K  [1206 resistor]  (hidden comment: Res SMD)
R117  VALOR: 10K  [1206 resistor]  (hidden comment: Res SMD)
R118  VALOR: 10K  [1206 resistor]  (hidden comment: Res SMD)
R119  Res2  value 47K  [1206 resistor]
R120  Res2  value 47K  [1206 resistor]
R121  Res2  value 47K  [1206 resistor]
R122  Res2  value 47K  [1206 resistor]
RP11  VALOR: 1K  [Trimpot Multivuelta Vertical]  (hidden comment: Trimpot)
RP12  VALOR: 1K  [Trimpot Multivuelta Vertical]  (hidden comment: Trimpot)
RP13  VALOR: 10K  [Trimpot Multivuelta Vertical]  (hidden comment: Trimpot)
RP14  VALOR: 10K  [Trimpot Multivuelta Vertical]  (hidden comment: Trimpot)
RP15  VALOR: 10K  [Trimpot Multivuelta Vertical]  (hidden comment: Trimpot)
RP16  VALOR: 10K  [Trimpot Multivuelta Vertical]  (hidden comment: Trimpot)
SPDT_1  SPDT on off  [DIP-6]
U12  AD5206  [948H-01]
U13  AD5206  [948H-01]
U14  LM7805  [TO-220_FullPak]
U15  TL084ACD  [751A-02_N]  (parts A,B,C,D of 4)

### Ports
12V, -12V, GND

### Nets
3.3V: Blue_1.18(3.3V) Blue_1.40(3.3V) C125.1 C127.2 C128.2 P17.7 P17.14
3V: RP11.3(TAP) U12.6(VDD) U13.6(VDD)
5V: Blue_1.38(5V) C119.1 C121.2 C122.2 C124.1 C129.1 C130.2 C131.2 P18.4 P19.1 U14.3(OUT)
12V: C123.1 P20.3 RP11.1(TOP) U14.1(IN) U15.4(V+) ; port 12V
-3V: RP12.3(TAP) U12.9(VSS) U13.9(VSS)
-12V: P20.1 RP12.1(TOP) U15.11(V-) ; port -12V
GND: Blue_1.19(G) Blue_1.20(G) Blue_1.39(G) C119.2 C121.1 C122.1 C123.2 C124.2 C125.2 C127.1 C128.1 C129.2 C130.1 C131.1 Jack3.3(Gnd) LED1.2(K) P17.13 P18.3 P19.2 P20.2 R119.1 R120.1 R121.1 R122.1 RP11.2(BOT) RP12.2(BOT) RP13.1(TOP) RP14.1(TOP) RP15.1(TOP) RP16.1(TOP) U12.3(B6) U12.4(Gnd) U12.10(B5) U12.13(B3) U12.16(B1) U12.21(B2) U12.24(B4) U13.3(B6) U13.4(Gnd) U13.10(B5) U13.13(B3) U13.16(B1) U13.21(B2) U13.24(B4) U14.2(GND) ; port GND
A0: Blue_1.5(A0) U13.5(CS)
A2: Blue_1.7(A2) P18.1
A3: Blue_1.8(A3) P18.2
A5: Blue_1.10(A5) P17.8 U12.8(CLK) U13.8(CLK)
A6: Blue_1.11(A6) P17.6
A7: Blue_1.12(A7) P17.9 U12.7(SDI) U13.7(SDI)
A10: Blue_1.27(A10) U12.5(CS)
B0: Blue_1.13(B0) P17.10
B1: Blue_1.14(B1) P17.11
B4: Blue_1.32(B4) P17.5
B5: Blue_1.33(B5) P17.4
B6: Blue_1.34(B6) P17.3
B7: Blue_1.35(B7) P17.2
B8: Blue_1.36(B8) P17.1
B10: Blue_1.15(B10) P17.12
JackL: RP16.2(BOT) SPDT_1.6 U15.14(OUT)
R1_a: P16.4 U12.1(A6)
R1_b: R111.1 U12.2(W6)
R2_a: P16.3 U12.12(A5)
R2_b: R112.1 U12.11(W5)
R3_a: P16.2 U12.22(A4)
R3_b: R113.1 U12.23(W4)
R4_a: P16.1 U12.15(A3)
R4_b: R114.1 U12.14(W3)
R5_a: P21.4 U13.1(A6)
R5_b: R115.1 U13.2(W6)
R6_a: P21.3 U13.12(A5)
R6_b: R116.1 U13.11(W5)
R7_a: P21.2 U13.22(A4)
R7_b: R117.1 U13.23(W4)
R8_a: P21.1 U13.15(A3)
R8_b: R118.1 U13.14(W3)
NetC120_1: C120.1 P19.3
NetC120_2: C120.2 R120.2 U15.5(IN+)
NetC126_1: C126.1 P19.4
NetC126_2: C126.2 R119.2 U15.3(IN+)
NetC132_1: C132.1 Jack3.1(R)
NetC132_2: C132.2 R121.2 U15.10(IN+)
NetC133_1: C133.1 Jack3.2(L)
NetC133_2: C133.2 R122.2 U15.12(IN+)
NetLED1_1: LED1.1(A) R110.1
NetP19_6: P19.6 R110.2
NetP22_1: P22.1 R111.2 R112.2 R113.2 R114.2
NetP22_2: P22.2 R115.2 R116.2 R117.2 R118.2
NetP23_1: P23.1 SPDT_1.2(B17)
NetP23_2: P23.2 SPDT_1.5
NetRP13_2: RP13.2(BOT) SPDT_1.1(B15) U15.1(OUT)
NetRP13_3: RP13.3(TAP) U15.2(IN-)
NetRP14_2: RP14.2(BOT) SPDT_1.4(B18) U15.7(OUT)
NetRP14_3: RP14.3(TAP) U15.6(IN-)
NetRP15_2: RP15.2(BOT) SPDT_1.3(B16) U15.8(OUT)
NetRP15_3: RP15.3(TAP) U15.9(IN-)
NetRP16_3: RP16.3(TAP) U15.13(IN-)

Not connected (* = marked no-connect by the designer): Blue_1 1(Vb) 2(C13) 3(C14) 4(C15) 6(A1) 9(A4) 16(B11) 17(R) 21(B12) 22(B13) 23(B14) 24(B15) 25(A8) 26(A9) 28(A11) 29(A12) 30(A15) 31(B3) 37(B9); P19 5 7; U12 17(W1) 18(A1) 19(A2) 20(W2); U13 17(W1) 18(A1) 19(A2) 20(W2)

### Library data of the parts
C119 C120 C123-C126 C129 C132 C133 = Cap Pol1: Polarized Capacitor (Radial); Published: 8-Jun-2000; LatestRevisionDate: 17-Jul-2002; LatestRevisionNote: Re-released for DXP Platform.; PackageReference: RB7.6-15; Publisher: Altium Limited; PackageDescription: Polarized Capacitor (Radial); 2 Leads
C121 C122 C127 C128 C130 C131 = Cap: Capacitor; Published: 8-Jun-2000; LatestRevisionDate: 17-Jul-2002; LatestRevisionNote: Re-released for DXP Platform.; PackageReference: RAD-0.3; Publisher: Altium Limited; PackageDescription: Radial Cap, Thru-Hole; 2 Leads; 0.3 in Pin Spacing
LED1 = Diodo Led: Led 3mm; FABRICANTE: Generico; CODIGO STI: *; PROVEEDOR: *; PART NUMBER: *
P16 P18 P21 = MHDR1X4: Header, 4-Pin; LatestRevisionDate: 17-Jul-2002; LatestRevisionNote: Re-released for DXP Platform.; Publisher: Altium Limited
P17 = Header 14: Header, 14-Pin; LatestRevisionDate: 17-Jul-2002; LatestRevisionNote: Re-released for DXP Platform.; Publisher: Altium Limited
P19 = Header 7: Header, 7-Pin; LatestRevisionDate: 17-Jul-2002; LatestRevisionNote: Re-released for DXP Platform.; Publisher: Altium Limited
P20 = Header 3: Header, 3-Pin; LatestRevisionDate: 17-Jul-2002; LatestRevisionNote: Re-released for DXP Platform.; Publisher: Altium Limited
P22 P23 = Header 2: Header, 2-Pin; LatestRevisionDate: 17-Jul-2002; LatestRevisionNote: Re-released for DXP Platform.; Publisher: Altium Limited
R110 R119-R122 = Res2: Resistor; Published: 8-Jun-2000; LatestRevisionDate: 17-Jul-2002; LatestRevisionNote: Re-released for DXP Platform.; PackageReference: AXIAL-0.4; Publisher: Altium Limited; PackageDescription: Axial Device, Thru-Hole; 2 Leads; 0.4 in Pin Spacing
RP11-RP16 = Trimpot: Preset; CODIGO STI: *; PROVEEDOR: *; FABRICANTE: *; PART NUMBER: *
U14 = LM78L12ACZ: 3-Terminal Positive Regulators, 3-pin TO-92; Manufacturer: National Semiconductor; PackageTopMarking: NSXYTT*LM78L*12ACZ; PowerWise: N; CompType: LDO IC; Published: 4-Dec-2008; DatasheetVersion: Apr-2006; PackageVersion: revG, Sep-2000; PackageReference: Z03A; Publisher: Altium Limited; PackageDescription: TO-92, Molded, 3 Lead; Supplier 1: Farnell; Supplier Part Number 1: 9490272; PartNumber: LM78L12ACZ; RoHS: N; PinCount: 3; Code_JEDEC: TO-226-AA; ComponentLink1Description: LM78L12 Datasheet; ComponentLink1URL: http://www.national.com/ds/LM/LM78L12.pdf; ComponentLink2Description: LM78L12 Web Page; ComponentLink2URL: http://www.national.com/pf/LM/LM78L12.html; ComponentLink3Description: Z03A Package Page; ComponentLink3URL: http://www.national.com/packaging/folders/z03a.html
U15 = TL084ACD: JFET-Input Operational Amplifier; Published: 17-Jul-2002; LatestRevisionDate: 13-Apr-2006; LatestRevisionNote: IPC-7351 Footprint Added.; DatasheetVersion: 1988; PackageVersion: 1991; PackageReference: 751A-02; Publisher: Altium Limited; PackageDescription: 14-Pin Small Outline Integrated Circuit 1.27 mm Pitch; Code_IPC: SOIC127P600-14; ComponentLink1Description: Manufacturer Link; ComponentLink1URL: http://www.onsemi.com/site/products/parametrics/0,4446,251,00.html
R111-R118 = Res SMD: CODIGO STI: *; PROVEEDOR: *; FABRICANTE: *; PART NUMBER: *